# Altium project Glasses.PrjPcb
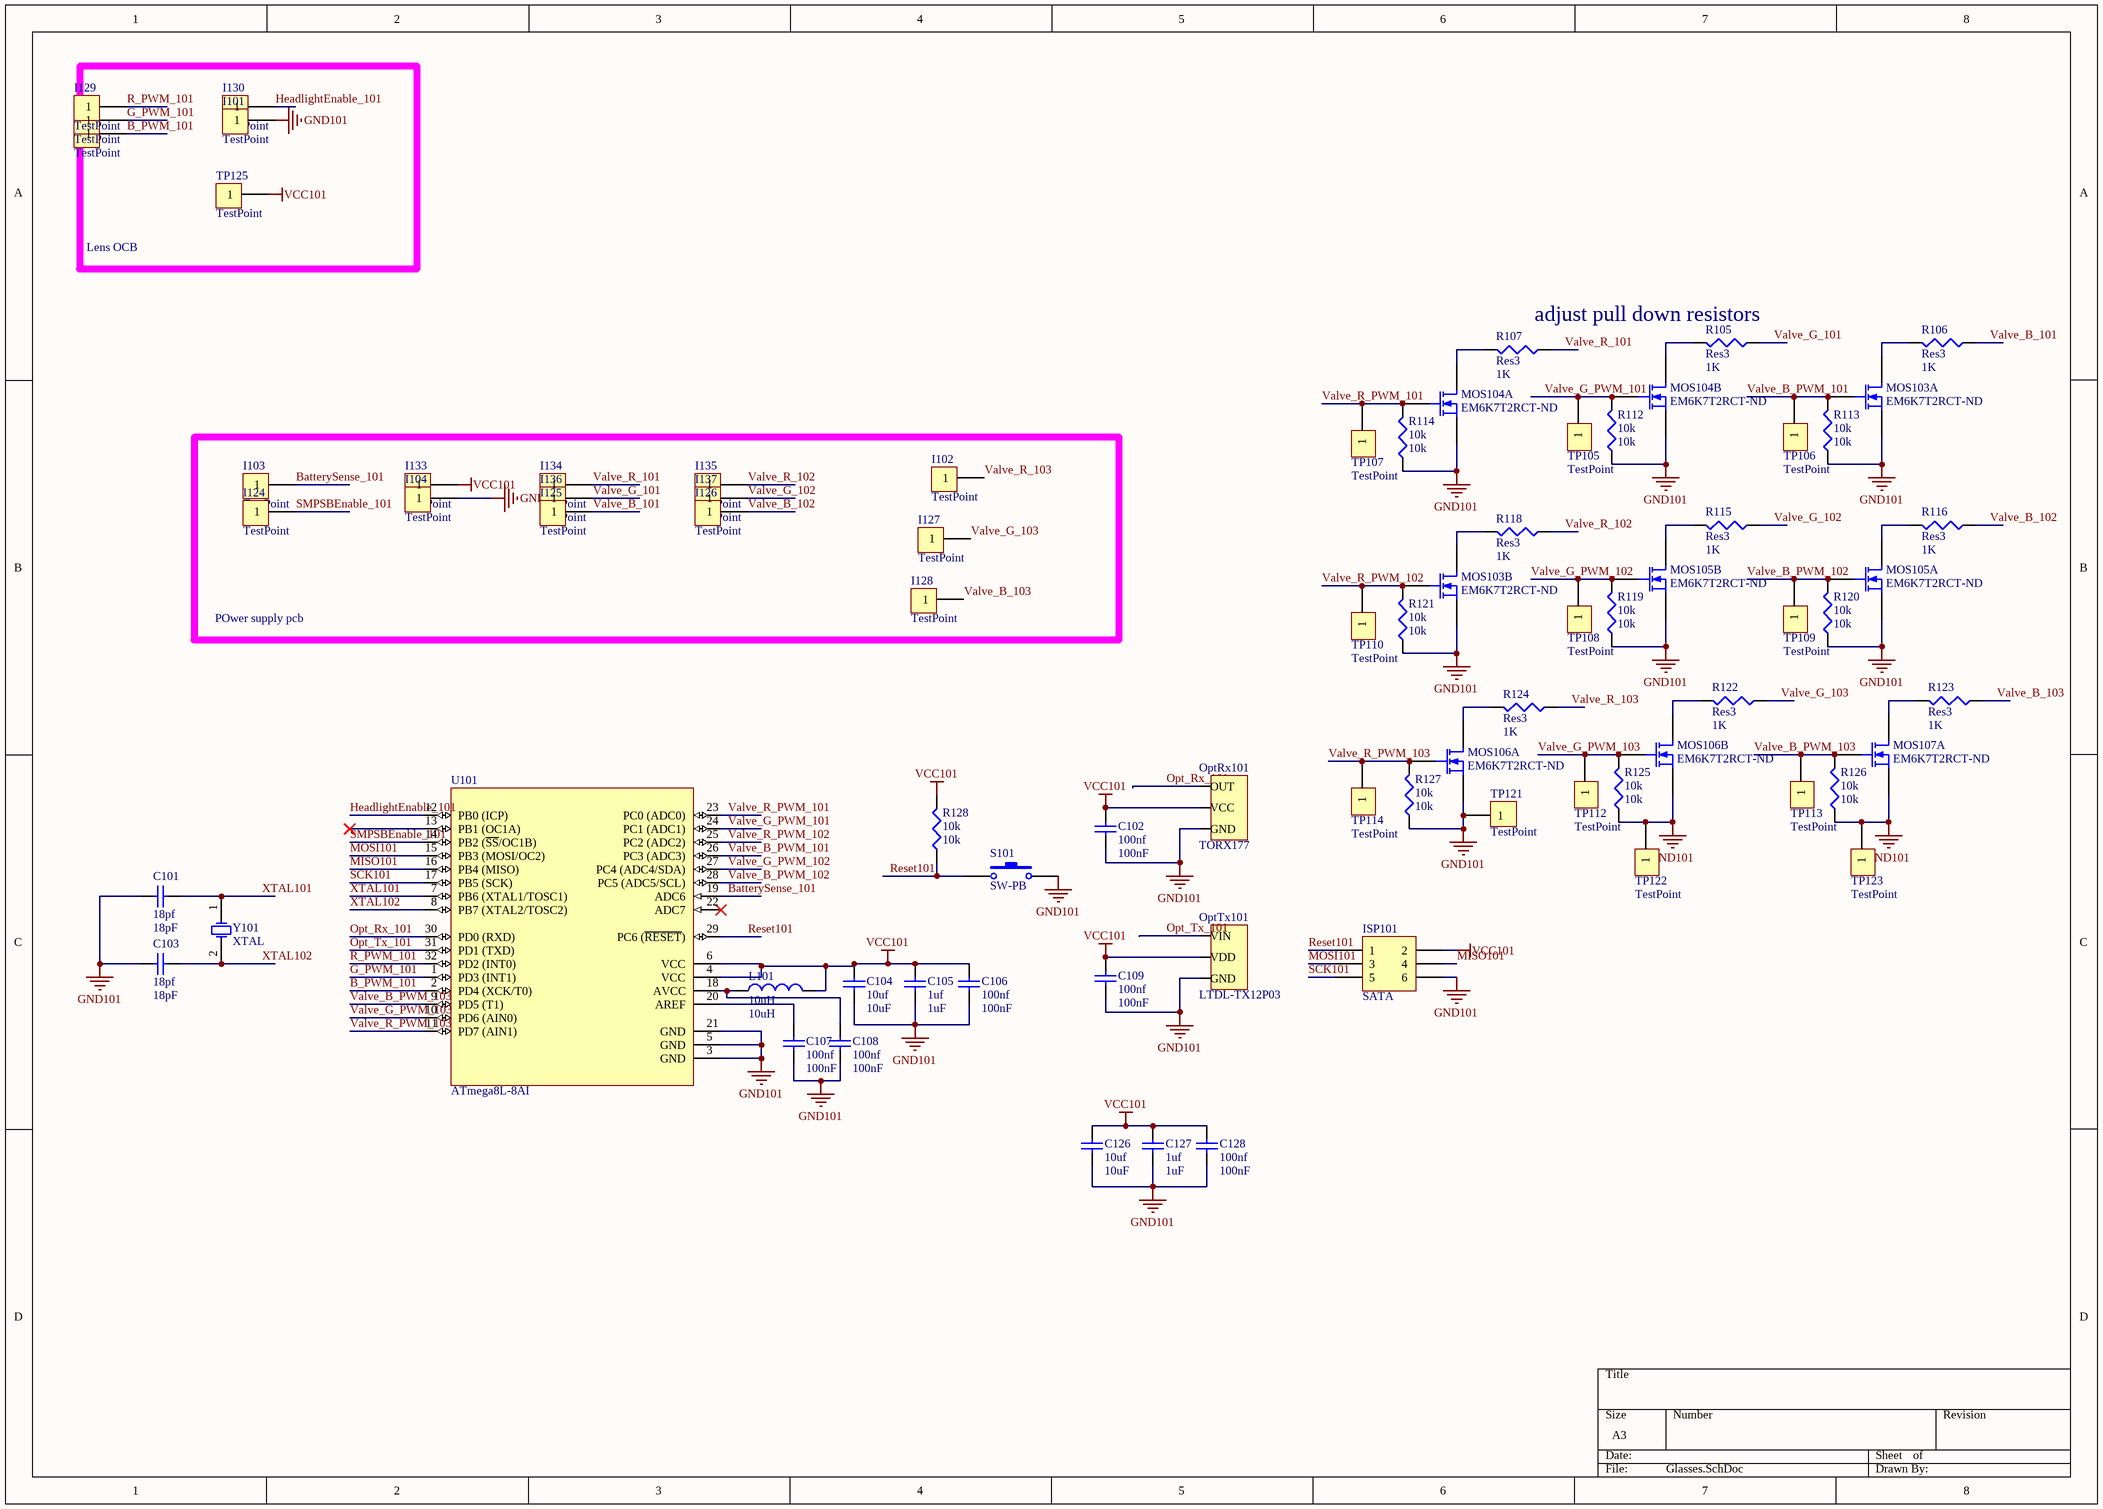
[diagram p0: Glasses.SchDoc]
8 sheets, 519 parts. Net scope: global (net labels, ports and power ports of the same name join across sheets).
Board file: MasterBoard.PcbDoc
Sheets:
  Glasses.SchDoc
  Valve.SchDoc
  Charger.SchDoc
  Controller.SchDoc
  Glasses-LEDBoard.SchDoc
  Glasses-PSUBoard.SchDoc
  Controller-IOBoard.SchDoc
  Glasses-LensBoard.SchDoc

## Sheet Glasses.SchDoc
size A3

### Parts
C101  18pf  [0603]
C102  100nf  [0603]
C103  18pf  [0603]
C104  10uf  [0805]
C105  1uf  [0603]
C106  100nf  [0603]
C107  100nf  [0603]
C108  100nf  [0603]
C109  100nf  [0603]
C126  10uf  [0805]
C127  1uf  [0603]
C128  100nf  [0603]
I101  TestPoint  [TestPoint]
I102  TestPoint  [TestPoint]
I103  TestPoint  [TestPoint]
I104  TestPoint  [TestPoint]
I124  TestPoint  [TestPoint]
I125  TestPoint  [TestPoint]
I126  TestPoint  [TestPoint]
I127  TestPoint  [TestPoint]
I128  TestPoint  [TestPoint]
I129  TestPoint  [TestPoint]
I130  TestPoint  [TestPoint]
I131  TestPoint  [TestPoint]
I132  TestPoint  [TestPoint]
I133  TestPoint  [TestPoint]
I134  TestPoint  [TestPoint]
I135  TestPoint  [TestPoint]
I136  TestPoint  [TestPoint]
I137  TestPoint  [TestPoint]
ISP101  SATA  [SATA]
L101  10uH  [0805]
MOS103  EM6K7T2RCT-ND  [EM6K7T2R-EMT6]  (parts A,B of 2)
MOS104  EM6K7T2RCT-ND  [EM6K7T2R-EMT6]  (parts A,B of 2)
MOS105  EM6K7T2RCT-ND  [EM6K7T2R-EMT6]  (parts A,B of 2)
MOS106  EM6K7T2RCT-ND  [EM6K7T2R-EMT6]  (parts A,B of 2)
MOS107  EM6K7T2RCT-ND  [EM6K7T2R-EMT6]  (part A of 2)
OptRx101  TORX177  [Optical RX]
OptTx101  LTDL-TX12P03  [Optical TX]
R105  Res3  value 1K  [0805]
R106  Res3  value 1K  [0805]
R107  Res3  value 1K  [0805]
R112  10k  [0603]
R113  10k  [0603]
R114  10k  [0603]
R115  Res3  value 1K  [0805]
R116  Res3  value 1K  [0805]
R118  Res3  value 1K  [0805]
R119  10k  [0603]
R120  10k  [0603]
R121  10k  [0603]
R122  Res3  value 1K  [0805]
R123  Res3  value 1K  [0805]
R124  Res3  value 1K  [0805]
R125  10k  [0603]
R126  10k  [0603]
R127  10k  [0603]
R128  10k  [0603]
S101  SW-PB  [2 pin switch (surface mount)]
TP105  TestPoint  [TestPoint]
TP106  TestPoint  [TestPoint]
TP107  TestPoint  [TestPoint]
TP108  TestPoint  [TestPoint]
TP109  TestPoint  [TestPoint]
TP110  TestPoint  [TestPoint]
TP112  TestPoint  [TestPoint]
TP113  TestPoint  [TestPoint]
TP114  TestPoint  [TestPoint]
TP121  TestPoint  [TestPoint]
TP122  TestPoint  [TestPoint]
TP123  TestPoint  [TestPoint]
TP125  TestPoint  [TestPoint]
U101  ATmega8L-8AI  [ATMega_GOOD]
Y101  XTAL  [ABLS-16MHz-B4-T]

### Blocks framed on the sheet
Lens OCB: I101 I129-I132 TP125
POwer supply pcb: I102-I104 I124-I128 I133-I137

### Nets
GND101: C101.1 C102.1 C103.1 C104.1 C105.1 C106.1 C107.1 C108.1 C109.1 C126.1 C127.1 C128.1 I101.1 I104.1 ISP101.6 MOS103.3(S) MOS103.6(S) MOS104.3(S) MOS104.6(S) MOS105.3(S) MOS105.6(S) MOS106.3(S) MOS106.6(S) MOS107.3(S) OptRx101.3(GND) OptTx101.3(GND) R112.1 R113.1 R114.1 R119.1 R120.1 R121.1 R125.1 R126.1 R127.1 S101.2 TP121.1 TP122.1 TP123.1 U101.3(GND) U101.5(GND) U101.21(GND)
VCC101: C102.2 C104.2 C105.2 C106.2 C109.2 C126.2 C127.2 C128.2 I133.1 ISP101.2 L101.2 OptRx101.2(VCC) OptTx101.2(VDD) R128.2 TP125.1 U101.4(VCC) U101.6(VCC)
B_PWM_101: I132.1 U101.2(PD4_(XCK/T0))
BatterySense_101: I103.1 U101.19(ADC6)
G_PWM_101: I131.1 U101.1(PD3_(INT1))
HeadlightEnable_101: I130.1 U101.12(PB0_(ICP))
MISO101: ISP101.4 U101.16(PB4_(MISO))
MOSI101: ISP101.3 U101.15(PB3_(MOSI/OC2))
Opt_Rx_101: OptRx101.1(OUT) U101.30(PD0_(RXD))
Opt_Tx_101: OptTx101.1(VIN) U101.31(PD1_(TXD))
R_PWM_101: I129.1 U101.32(PD2_(INT0))
Reset101: ISP101.1 R128.1 S101.1 U101.29(PC6_(~{RESET}))
SCK101: ISP101.5 U101.17(PB5_(SCK))
SMPSBEnable_101: I124.1 U101.14(PB2_(~{SS}/OC1B))
Valve_B_101: I125.1 R106.1
Valve_B_102: I126.1 R116.1
Valve_B_103: I128.1 R123.1
Valve_B_PWM_101: MOS103.2(G) R113.2 TP106.1 U101.26(PC3_(ADC3))
Valve_B_PWM_102: MOS105.2(G) R120.2 TP109.1 U101.28(PC5_(ADC5/SCL))
Valve_B_PWM_103: MOS107.2(G) R126.2 TP113.1 U101.9(PD5_(T1))
Valve_G_101: I136.1 R105.1
Valve_G_102: I137.1 R115.1
Valve_G_103: I127.1 R122.1
Valve_G_PWM_101: MOS104.5(G) R112.2 TP105.1 U101.24(PC1_(ADC1))
Valve_G_PWM_102: MOS105.5(G) R119.2 TP108.1 U101.27(PC4_(ADC4/SDA))
Valve_G_PWM_103: MOS106.5(G) R125.2 TP112.1 U101.10(PD6_(AIN0))
Valve_R_101: I134.1 R107.1
Valve_R_102: I135.1 R118.1
Valve_R_103: I102.1 R124.1
Valve_R_PWM_101: MOS104.2(G) R114.2 TP107.1 U101.23(PC0_(ADC0))
Valve_R_PWM_102: MOS103.5(G) R121.2 TP110.1 U101.25(PC2_(ADC2))
Valve_R_PWM_103: MOS106.2(G) R127.2 TP114.1 U101.11(PD7_(AIN1))
XTAL101: C101.2 U101.7(PB6_(XTAL1/TOSC1)) Y101.1(OSC1)
XTAL102: C103.2 U101.8(PB7_(XTAL2/TOSC2)) Y101.2(OSC2)
NetC107_2: C107.2 U101.20(AREF)
NetC108_2: C108.2 L101.1 U101.18(AVCC)
NetMOS103_1: MOS103.1(D) R106.2
NetMOS103_4: MOS103.4(D) R118.2
NetMOS104_1: MOS104.1(D) R107.2
NetMOS104_4: MOS104.4(D) R105.2
NetMOS105_1: MOS105.1(D) R116.2
NetMOS105_4: MOS105.4(D) R115.2
NetMOS106_1: MOS106.1(D) R124.2
NetMOS106_4: MOS106.4(D) R122.2
NetMOS107_1: MOS107.1(D) R123.2

Not connected (* = marked no-connect by the designer): U101 13(PB1_(OC1A))* 22(ADC7)*

### Notes on the sheet
- adjust pull down resistors

### Library data of the parts
C101-C109 C126-C128 = Cap Semi: Capacitor (Semiconductor SIM Model); Published: 8-Jun-2000; LatestRevisionDate: 29-May-2009; LatestRevisionNote: IPC-7351 Footprint Added.; PackageReference: C1206; Publisher: Altium Limited; PackageDescription: Chip Capacitor
  C101 C103: Value: 18pF
  C102 C106-C109 C128: Value: 100nF
  C104 C126: Value: 10uF
  C105 C127: Value: 1uF
ISP101 = Header 3X2: Header, 3-Pin, Dual row; LatestRevisionDate: 17-Jul-2002; LatestRevisionNote: Re-released for DXP Platform.; Publisher: Altium Limited
L101 = Inductor: Code_IEC: 1005; Published: 8-Jun-2000; LatestRevisionDate: 29-May-2009; LatestRevisionNote: IPC-7351 Footprint Added.; PackageReference: 0402-A; Publisher: Altium Limited; PackageDescription: Chip Inductor; Code_JEITA: 0402; Value: 10uH
OptRx101 = TORX177: Optical receiver module
OptTx101 = LTDL-TX12P03: Optical transmitter
R105-R107 R112-R116 R118-R128 = Res3: Resistor; Published: 8-Jun-2000; LatestRevisionDate: 29-May-2009; LatestRevisionNote: IPC-7351 Footprint Added.; PackageReference: J1-0603; Publisher: Altium Limited; PackageDescription: Chip Resistor
  R112-R114 R119-R121 R125-R128: Value: 10k
S101 = SW-PB: Switch; Published: 24-Mar-1999; LatestRevisionDate: 17-Jul-2002; LatestRevisionNote: Re-released for DXP Platform.; PackageReference: SPST-2; Publisher: Altium Limited
U101 = ATmega8L-8AI: 8-Bit AVR Microcontroller with 8K Bytes of In-System Programmable Flash Memory; Published: 17-Sep-2003; LatestRevisionDate: 13-Apr-2006; LatestRevisionNote: IPC-7351 Footprint Added.; DatasheetVersion: 2486H-AVR-09/02; PackageVersion: revB, Oct-2001; PackageReference: 32A; Publisher: Altium Limited; PackageDescription: 32-Pin Thin Quad Flat Pack 0.8 mm Pitch; Code_JEDEC: MS-026-ABA; ComponentLink1Description: Manufacturer Link; ComponentLink1URL: http://www.atmel.com; ComponentLink2Description: Datasheet; ComponentLink2URL: http://www.atmel.com/dyn/resources/prod_documents/doc2486.pdf
Y101 = XTAL: Crystal Oscillator; Published: 8-Jun-2000; LatestRevisionDate: 17-Jul-2002; LatestRevisionNote: Re-released for DXP Platform.; PackageReference: R38; Publisher: Altium Limited
MOS103-MOS107 = EM6K7T2RCT-ND: Supplier 1: Digi-Key

## Sheet Valve.SchDoc
size A3
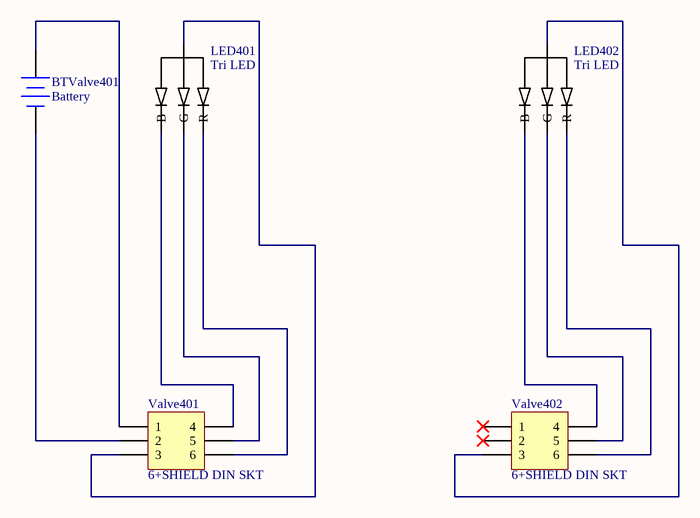
[diagram p1: Valve.SchDoc]

### Parts
BTValve401  Battery  [BAT-2]
LED401  Tri LED  [CLV1A-FKB]
LED402  Tri LED  [CLV1A-FKB]
Valve401  6+SHIELD DIN SKT  [Valve male]
Valve402  6+SHIELD DIN SKT  [Valve male]

### Nets
NetBTValve401_1: BTValve401.1(+) Valve401.1
NetBTValve401_2: BTValve401.2(-) Valve401.2
NetLED401_1: LED401.1(R) Valve401.6
NetLED401_2: LED401.2(Common) Valve401.3
NetLED401_3: LED401.3(B) Valve401.4
NetLED401_4: LED401.4(G) Valve401.5
NetLED402_1: LED402.1(R) Valve402.6
NetLED402_2: LED402.2(Common) Valve402.3
NetLED402_3: LED402.3(B) Valve402.4
NetLED402_4: LED402.4(G) Valve402.5

Not connected (* = marked no-connect by the designer): Valve402 1* 2*

### Library data of the parts
BTValve401 = Battery: Multicell Battery; Published: 24-Mar-1999; LatestRevisionDate: 17-Jul-2002; LatestRevisionNote: Re-released for DXP Platform.; PackageReference: BAT-2; Publisher: Altium Limited
Valve401 Valve402 = Header 3X2A: Header, 3-Pin, Dual row; LatestRevisionDate: 17-Jul-2002; LatestRevisionNote: Re-released for DXP Platform.; Publisher: Altium Limited

## Sheet Charger.SchDoc
size A3
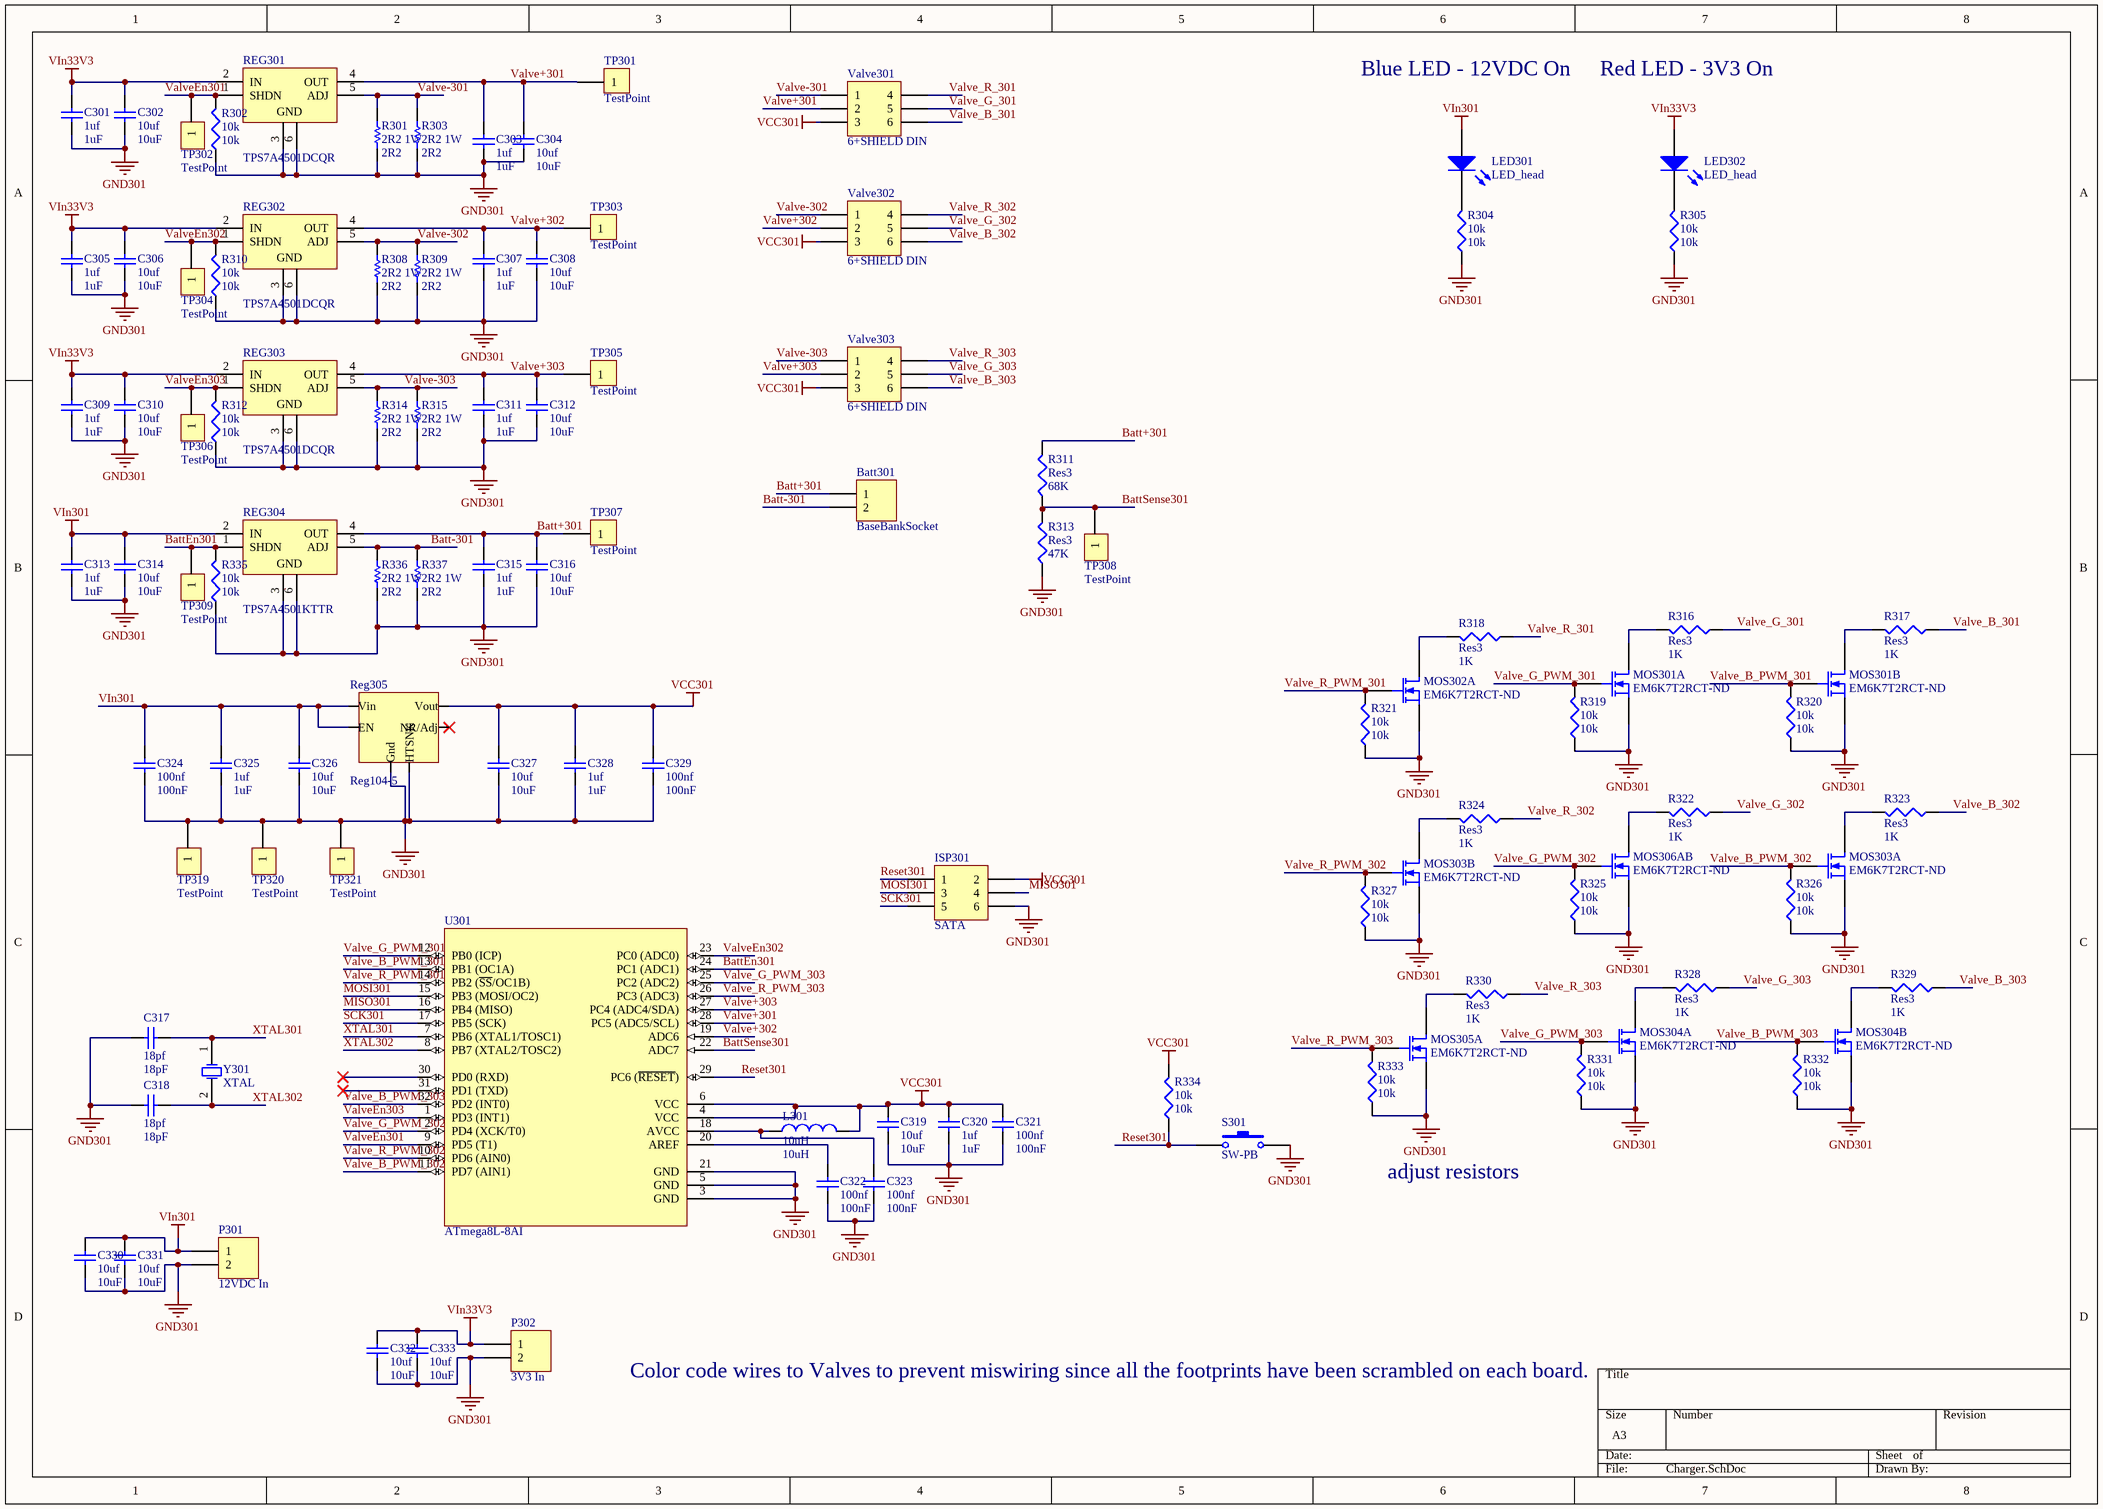
[diagram p2: Charger.SchDoc]

### Parts
Batt301  BaseBankSocket  [HDR1X2H]
C301  1uf  [0603]
C302  10uf  [0805]
C303  1uf  [0603]
C304  10uf  [0805]
C305  1uf  [0603]
C306  10uf  [0805]
C307  1uf  [0603]
C308  10uf  [0805]
C309  1uf  [0603]
C310  10uf  [0805]
C311  1uf  [0603]
C312  10uf  [0805]
C313  1uf  [0603]
C314  10uf  [0805]
C315  1uf  [0603]
C316  10uf  [0805]
C317  18pf  [0603]
C318  18pf  [0603]
C319  10uf  [0805]
C320  1uf  [0603]
C321  100nf  [0603]
C322  100nf  [0603]
C323  100nf  [0603]
C324  100nf  [0603]
C325  1uf  [0603]
C326  10uf  [0805]
C327  10uf  [0805]
C328  1uf  [0603]
C329  100nf  [0603]
C330  10uf  [0805]
C331  10uf  [0805]
C332  10uf  [0805]
C333  10uf  [0805]
ISP301  SATA  [SATA]
L301  10uH  [0805]
LED301  LED_head  [2 pin switch (surface mount)]
LED302  LED_head  [2 pin switch (surface mount)]
MOS301  EM6K7T2RCT-ND  (parts A,B of 2)
MOS302  EM6K7T2RCT-ND  (part A of 2)
MOS303  EM6K7T2RCT-ND  (parts A,B of 2)
MOS304  EM6K7T2RCT-ND  (parts A,B of 2)
MOS305  EM6K7T2RCT-ND  (part A of 2)
MOS306A  EM6K7T2RCT-ND  (part B of 2)
P301  12VDC In  [HDR1X2H]
P302  3V3 In  [HDR1X2H]
R301  2R2 1W  value 2R2  [Resistor 1W]
R302  10k  [0603]
R303  2R2 1W  value 2R2  [Resistor 1W]
R304  10k  [0603]
R305  10k  [0603]
R308  2R2 1W  value 2R2  [Resistor 1W]
R309  2R2 1W  value 2R2  [Resistor 1W]
R310  10k  [0603]
R311  Res3  value 68K  [0805]
R312  10k  [0603]
R313  Res3  value 47K  [0805]
R314  2R2 1W  value 2R2  [Resistor 1W]
R315  2R2 1W  value 2R2  [Resistor 1W]
R316  Res3  value 1K  [0805]
R317  Res3  value 1K  [0805]
R318  Res3  value 1K  [0805]
R319  10k  [0603]
R320  10k  [0603]
R321  10k  [0603]
R322  Res3  value 1K  [0805]
R323  Res3  value 1K  [0805]
R324  Res3  value 1K  [0805]
R325  10k  [0603]
R326  10k  [0603]
R327  10k  [0603]
R328  Res3  value 1K  [0805]
R329  Res3  value 1K  [0805]
R330  Res3  value 1K  [0805]
R331  10k  [0603]
R332  10k  [0603]
R333  10k  [0603]
R334  10k  [0603]
R335  10k  [0603]
R336  2R2 1W  value 2R2  [Resistor 1W]
R337  2R2 1W  value 2R2  [Resistor 1W]
REG301  TPS7A4501DCQR  [TPS7A4501KTTR heatsinked]
REG302  TPS7A4501DCQR  [TPS7A4501KTTR heatsinked]
REG303  TPS7A4501DCQR  [TPS7A4501KTTR heatsinked]
REG304  TPS7A4501KTTR  [TPS7A4501KTTR heatsinked]
Reg305  Reg104-5  [REG104-5-DDPAK5]
S301  SW-PB  [0805]
TP301  TestPoint  [TestPoint]
TP302  TestPoint  [TestPoint]
TP303  TestPoint  [TestPoint]
TP304  TestPoint  [TestPoint]
TP305  TestPoint  [TestPoint]
TP306  TestPoint  [TestPoint]
TP307  TestPoint  [TestPoint]
TP308  TestPoint  [TestPoint]
TP309  TestPoint  [TestPoint]
TP319  TestPoint  [TestPoint]
TP320  TestPoint  [TestPoint]
TP321  TestPoint  [TestPoint]
U301  ATmega8L-8AI  [ATMega_GOOD]
Valve301  6+SHIELD DIN  [Valve male]
Valve302  6+SHIELD DIN  [Valve male]
Valve303  6+SHIELD DIN  [Valve male]
Y301  XTAL  [ABLS-16MHz-B4-T]

### Nets
GND301: C301.1 C302.1 C303.1 C304.1 C305.1 C306.1 C307.1 C308.1 C309.1 C310.1 C311.1 C312.1 C313.1 C314.1 C315.1 C316.1 C317.1 C318.1 C319.1 C320.1 C321.1 C322.1 C323.1 C324.1 C325.1 C326.1 C327.1 C328.1 C329.1 C330.1 C331.1 C332.1 C333.1 ISP301.6 MOS301.1(S) MOS301.4(S) MOS302.1(S) MOS303.1(S) MOS303.4(S) MOS304.1(S) MOS304.4(S) MOS305.1(S) MOS306A.4(S) P301.2 P302.2 R301.2 R302.1 R303.2 R304.1 R305.1 R308.2 R309.2 R310.1 R312.1 R313.1 R314.1 R315.1 R319.1 R320.1 R321.1 R325.1 R326.1 R327.1 R331.1 R332.1 R333.1 R335.1 R336.1 R337.1 REG301.3(GND) REG301.6(GND) REG302.3(GND) REG302.6(GND) REG303.3(GND) REG303.6(GND) REG304.3(GND) REG304.6(GND) Reg305.3(Gnd) Reg305.6(HTSNK) S301.2 TP319.1 TP320.1 TP321.1 U301.3(GND) U301.5(GND) U301.21(GND)
VCC301: C319.2 C320.2 C321.2 C327.2 C328.2 C329.2 ISP301.2 L301.2 R334.2 Reg305.2(Vout) U301.4(VCC) U301.6(VCC) Valve301.3 Valve302.3 Valve303.3
VIn33V3: C301.2 C302.2 C305.2 C306.2 C309.2 C310.2 C332.2 C333.2 LED302.1(A) P302.1 REG301.2(IN) REG302.2(IN) REG303.2(IN)
VIn301: C313.2 C314.2 C324.2 C325.2 C326.2 C330.2 C331.2 LED301.1(A) P301.1 REG304.2(IN) Reg305.1(Vin) Reg305.5(EN)
Batt+301: Batt301.1 C315.2 C316.2 R311.2 REG304.4(OUT) TP307.1
Batt-301: Batt301.2 R336.2 R337.2 REG304.5(ADJ)
BattEn301: R335.2 REG304.1(SHDN) TP309.1 U301.24(PC1_(ADC1))
BattSense301: R311.1 R313.2 TP308.1 U301.22(ADC7)
MISO301: ISP301.4 U301.16(PB4_(MISO))
MOSI301: ISP301.3 U301.15(PB3_(MOSI/OC2))
Reset301: ISP301.1 R334.1 S301.1 U301.29(PC6_(~{RESET}))
SCK301: ISP301.5 U301.17(PB5_(SCK))
Valve+301: C303.2 C304.2 REG301.4(OUT) TP301.1 U301.28(PC5_(ADC5/SCL)) Valve301.2
Valve+302: C307.2 C308.2 REG302.4(OUT) TP303.1 U301.19(ADC6) Valve302.2
Valve+303: C311.2 C312.2 REG303.4(OUT) TP305.1 U301.27(PC4_(ADC4/SDA)) Valve303.2
Valve-301: R301.1 R303.1 REG301.5(ADJ) Valve301.1
Valve-302: R308.1 R309.1 REG302.5(ADJ) Valve302.1
Valve-303: R314.2 R315.2 REG303.5(ADJ) Valve303.1
Valve_B_301: R317.1 Valve301.6
Valve_B_302: R323.1 Valve302.6
Valve_B_303: R329.1 Valve303.6
Valve_B_PWM_301: MOS301.5(G) R320.2 U301.13(PB1_(OC1A))
Valve_B_PWM_302: MOS303.2(G) R326.2 U301.11(PD7_(AIN1))
Valve_B_PWM_303: MOS304.5(G) R332.2 U301.32(PD2_(INT0))
Valve_G_301: R316.1 Valve301.5
Valve_G_302: R322.1 Valve302.5
Valve_G_303: R328.1 Valve303.5
Valve_G_PWM_301: MOS301.2(G) R319.2 U301.12(PB0_(ICP))
Valve_G_PWM_302: MOS306A.5(G) R325.2 U301.2(PD4_(XCK/T0))
Valve_G_PWM_303: MOS304.2(G) R331.2 U301.25(PC2_(ADC2))
Valve_R_301: R318.1 Valve301.4
Valve_R_302: R324.1 Valve302.4
Valve_R_303: R330.1 Valve303.4
Valve_R_PWM_301: MOS302.2(G) R321.2 U301.14(PB2_(~{SS}/OC1B))
Valve_R_PWM_302: MOS303.5(G) R327.2 U301.10(PD6_(AIN0))
Valve_R_PWM_303: MOS305.2(G) R333.2 U301.26(PC3_(ADC3))
ValveEn301: R302.2 REG301.1(SHDN) TP302.1 U301.9(PD5_(T1))
ValveEn302: R310.2 REG302.1(SHDN) TP304.1 U301.23(PC0_(ADC0))
ValveEn303: R312.2 REG303.1(SHDN) TP306.1 U301.1(PD3_(INT1))
XTAL301: C317.2 U301.7(PB6_(XTAL1/TOSC1)) Y301.1(OSC1)
XTAL302: C318.2 U301.8(PB7_(XTAL2/TOSC2)) Y301.2(OSC2)
NetC322_2: C322.2 U301.20(AREF)
NetC323_2: C323.2 L301.1 U301.18(AVCC)
NetLED301_2: LED301.2(K) R304.2
NetLED302_2: LED302.2(K) R305.2
NetMOS301_3: MOS301.3(D) R317.2
NetMOS301_6: MOS301.6(D) R316.2
NetMOS302_6: MOS302.6(D) R318.2
NetMOS303_3: MOS303.3(D) R324.2
NetMOS303_6: MOS303.6(D) R323.2
NetMOS304_3: MOS304.3(D) R329.2
NetMOS304_6: MOS304.6(D) R328.2
NetMOS305_6: MOS305.6(D) R330.2
NetMOS306A_3: MOS306A.3(D) R322.2

Not connected (* = marked no-connect by the designer): Reg305 4(NR/Adj)*; U301 30(PD0_(RXD))* 31(PD1_(TXD))*

### Notes on the sheet
- Blue LED - 12VDC On
- Red LED - 3V3 On
- adjust resistors
- Color code wires to Valves to prevent miswiring since all the footprints have been scrambled on each board.

### Library data of the parts
Batt301 = Header 2: Header, 2-Pin; LatestRevisionDate: 17-Jul-2002; LatestRevisionNote: Re-released for DXP Platform.; Publisher: Altium Limited
C301-C333 = Cap Semi: Capacitor (Semiconductor SIM Model); Published: 8-Jun-2000; LatestRevisionDate: 29-May-2009; LatestRevisionNote: IPC-7351 Footprint Added.; PackageReference: C1206; Publisher: Altium Limited; PackageDescription: Chip Capacitor
  C301 C303 C305 C307 C309 C311 C313 C315 C320 C325 C328: Value: 1uF
  C302 C304 C306 C308 C310 C312 C314 C316 C319 C326 C327 C330-C333: Value: 10uF
  C317 C318: Value: 18pF
  C321-C324 C329: Value: 100nF
ISP301 = Header 3X2: Header, 3-Pin, Dual row; LatestRevisionDate: 17-Jul-2002; LatestRevisionNote: Re-released for DXP Platform.; Publisher: Altium Limited
L301 = Inductor: Code_IEC: 1005; Published: 8-Jun-2000; LatestRevisionDate: 29-May-2009; LatestRevisionNote: IPC-7351 Footprint Added.; PackageReference: 0402-A; Publisher: Altium Limited; PackageDescription: Chip Inductor; Code_JEITA: 0402; Value: 10uH
LED301 LED302 = LED0: Typical INFRARED GaAs LED; Published: 8-Jun-2000; LatestRevisionDate: 08-Jul-2005; LatestRevisionNote: Mech Layer 1 removed.; PackageReference: LED-0; Publisher: Altium Limited
P301 P302 = Header 2H: Header, 2-Pin, Right Angle; LatestRevisionDate: 17-Jul-2002; LatestRevisionNote: Re-released for DXP Platform.; Publisher: Altium Limited
R301 R303 R308 R309 R314 R315 R336 R337 = Res1: Resistor; Published: 8-Jun-2000; LatestRevisionDate: 17-Jul-2002; LatestRevisionNote: Re-released for DXP Platform.; PackageReference: AXIAL-0.3; Publisher: Altium Limited
R302 R304 R305 R310-R313 R316-R335 = Res3: Resistor; Published: 8-Jun-2000; LatestRevisionDate: 29-May-2009; LatestRevisionNote: IPC-7351 Footprint Added.; PackageReference: J1-0603; Publisher: Altium Limited; PackageDescription: Chip Resistor
  R302 R304 R305 R310 R312 R319-R321 R325-R327 R331-R335: Value: 10k
REG301-REG303 = TPS7A4515
REG304 = TPS7A4501
S301 = SW-PB: Switch; Published: 24-Mar-1999; LatestRevisionDate: 17-Jul-2002; LatestRevisionNote: Re-released for DXP Platform.; PackageReference: SPST-2; Publisher: Altium Limited
U301 = ATmega8L-8AI: as U101 on sheet Glasses; Published: 17-Sep-2003; LatestRevisionDate: 13-Apr-2006; LatestRevisionNote: IPC-7351 Footprint Added.; DatasheetVersion: 2486H-AVR-09/02; PackageVersion: revB, Oct-2001; PackageReference: 32A; Publisher: Altium Limited; PackageDescription: 32-Pin Thin Quad Flat Pack 0.8 mm Pitch; Code_JEDEC: MS-026-ABA; ComponentLink1Description: Manufacturer Link; ComponentLink1URL: http://www.atmel.com; ComponentLink2Description: Datasheet; ComponentLink2URL: http://www.atmel.com/dyn/resources/prod_documents/doc2486.pdf
Valve301-Valve303 = Header 3X2A: Header, 3-Pin, Dual row; LatestRevisionDate: 17-Jul-2002; LatestRevisionNote: Re-released for DXP Platform.; Publisher: Altium Limited
Y301 = XTAL: Crystal Oscillator; Published: 8-Jun-2000; LatestRevisionDate: 17-Jul-2002; LatestRevisionNote: Re-released for DXP Platform.; PackageReference: R38; Publisher: Altium Limited
MOS301-MOS305 MOS306A = EM6K7T2RCT-ND: Supplier 1: Digi-Key

## Sheet Controller.SchDoc
size A2
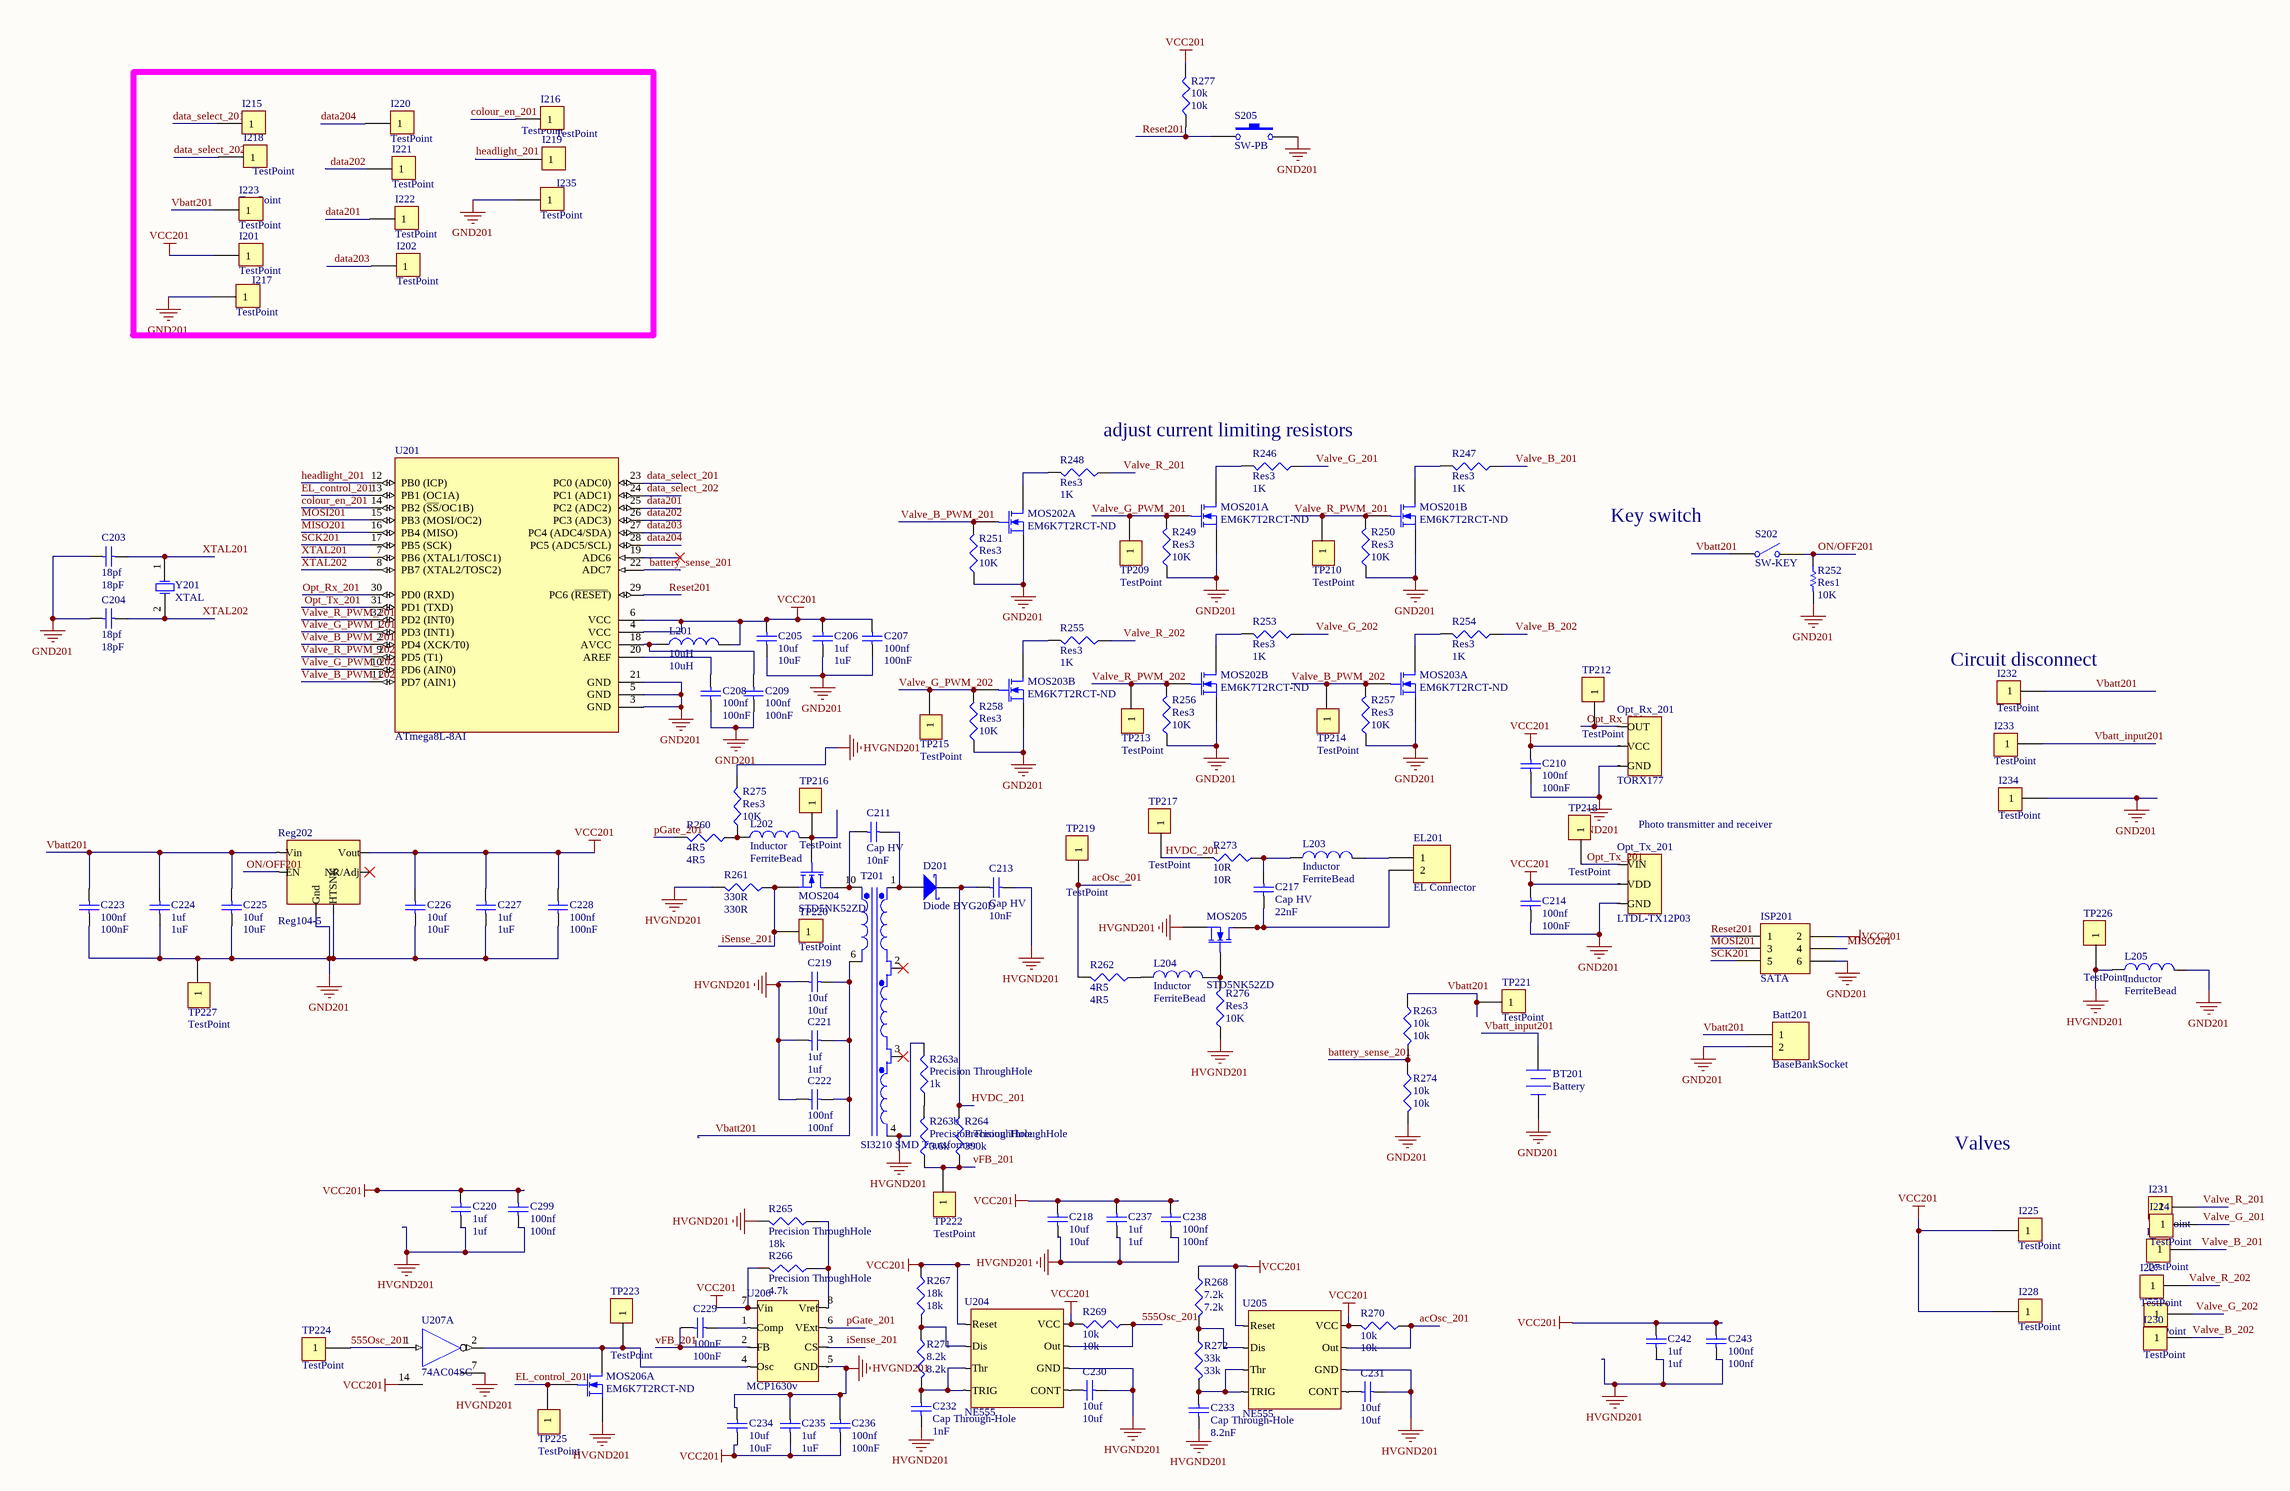
[diagram p3: Controller.SchDoc]

### Parts
Batt201  BaseBankSocket  [HDR1X2H]
BT201  Battery  [HDR1X2H]
C203  18pf  [0603]
C204  18pf  [0603]
C205  10uf  [0805]
C206  1uf  [0603]
C207  100nf  [0603]
C208  100nf  [0603]
C209  100nf  [0603]
C210  100nf  [0603]
C211  Cap HV  value 10nF  [10n MU Capacitor (HV)]
C213  Cap HV  value 10nF  [10n MU Capacitor (HV)]
C214  100nf  [0603]
C217  Cap HV  value 22nF  [22N MU Capacitor (HV)]
C218  10uf  [0805]
C219  10uf  [0805]
C220  1uf  [0603]
C221  1uf  [0603]
C222  100nf  [0603]
C223  100nf  [0603]
C224  1uf  [0603]
C225  10uf  [0805]
C226  10uf  [0805]
C227  1uf  [0603]
C228  100nf  [0603]
C229  100nF  [0603]
C230  10uf  [0805]
C231  10uf  [0805]
C232  Cap Through-Hole  value 1nF  [Axial 0.4 MU]
C233  Cap Through-Hole  value 8.2nF  [Axial 0.4 MU]
C234  10uf  [0805]
C235  1uf  [0603]
C236  100nf  [0603]
C237  1uf  [0603]
C238  100nf  [0603]
C242  1uf  [0603]
C243  100nf  [0603]
C299  100nf  [0603]
D201  Diode BYG20D  [BYG20J-E3]
EL201  EL Connector  [HV connector]
I201  TestPoint  [TestPoint]
I202  TestPoint  [TestPoint]
I215  TestPoint  [TestPoint]
I216  TestPoint  [TestPoint]
I217  TestPoint  [TestPoint]
I218  TestPoint  [TestPoint]
I219  TestPoint  [TestPoint]
I220  TestPoint  [TestPoint]
I221  TestPoint  [TestPoint]
I222  TestPoint  [TestPoint]
I223  TestPoint  [TestPoint]
I224  TestPoint  [TestPoint]
I225  TestPoint  [TestPoint]
I226  TestPoint  [TestPoint]
I227  TestPoint  [TestPoint]
I228  TestPoint  [TestPoint]
I229  TestPoint  [TestPoint]
I230  TestPoint  [TestPoint]
I231  TestPoint  [TestPoint]
I232  TestPoint  [TestPoint]
I233  TestPoint  [TestPoint]
I234  TestPoint  [TestPoint]
I235  TestPoint  [TestPoint]
ISP201  SATA  [SATA]
L201  10uH  [0805]
L202  Inductor  value FerriteBead  [Axial 0.4 MU]
L203  Inductor  value FerriteBead  [Axial 0.4 MU]
L204  Inductor  value FerriteBead  [Axial 0.4 MU]
L205  Inductor  value FerriteBead  [Axial 0.4 MU]
MOS201  EM6K7T2RCT-ND  [EM6K7T2R-EMT6]  (parts A,B of 2)
MOS202  EM6K7T2RCT-ND  [EM6K7T2R-EMT6]  (parts A,B of 2)
MOS203  EM6K7T2RCT-ND  [EM6K7T2R-EMT6]  (parts A,B of 2)
MOS204  STD5NK52ZD  [DPAK]
MOS205  STD5NK52ZD  [DPAK]
MOS206  EM6K7T2RCT-ND  [EM6K7T2R-EMT6]  (part A of 2)
Opt_Rx_201  TORX177  [Optical RX]
Opt_Tx_201  LTDL-TX12P03  [Optical TX]
R246  Res3  value 1K  [0805]
R247  Res3  value 1K  [0805]
R248  Res3  value 1K  [0805]
R249  Res3  value 10K  [0805]
R250  Res3  value 10K  [0805]
R251  Res3  value 10K  [0805]
R252  Res1  value 10K  [0805]
R253  Res3  value 1K  [0805]
R254  Res3  value 1K  [0805]
R255  Res3  value 1K  [0805]
R256  Res3  value 10K  [0805]
R257  Res3  value 10K  [0805]
R258  Res3  value 10K  [0805]
R260  4R5  [0805]
R261  330R  [0805]
R262  4R5  [0805]
R263  10k  [0603]
R263a  Precision ThroughHole  value 1k  [Axial 0.4 MU]
R263b  Precision ThroughHole  value 3.6k  [Axial 0.4 MU]
R264  Precision ThroughHole  value 390k  [Axial 0.4 MU]
R265  Precision ThroughHole  value 18k  [Axial 0.4 MU]
R266  Precision ThroughHole  value 4.7k  [Axial 0.4 MU]
R267  18k  [0603]
R268  7.2k  [0805]
R269  10k  [0603]
R270  10k  [0603]
R271  8.2k  [0805]
R272  33k  [0805]
R273  10R  [0805]
R274  10k  [0603]
R275  Res3  value 10K  [0805]
R276  Res3  value 10K  [0805]
R277  10k  [0603]
Reg202  Reg104-5  [REG104-5-DDPAK5]
S202  SW-KEY  [2 pin switch (surface mount)]
S205  SW-PB  [2 pin switch (surface mount)]
T201  SI3210 SMD Transformer  [SI3210 SMD Transformer]
TP209  TestPoint  [TestPoint]
TP210  TestPoint  [TestPoint]
TP212  TestPoint  [TestPoint]
TP213  TestPoint  [TestPoint]
TP214  TestPoint  [TestPoint]
TP215  TestPoint  [TestPoint]
TP216  TestPoint  [TestPoint]
TP217  TestPoint  [TestPoint]
TP218  TestPoint  [TestPoint]
TP219  TestPoint  [TestPoint]
TP220  TestPoint  [TestPoint]
TP221  TestPoint  [TestPoint]
TP222  TestPoint  [TestPoint]
TP223  TestPoint  [TestPoint]
TP224  TestPoint  [TestPoint]
TP225  TestPoint  [TestPoint]
TP226  TestPoint  [TestPoint]
TP227  TestPoint  [TestPoint]
U201  ATmega8L-8AI  [ATMega_GOOD]
U204  NE555  [NE555]
U205  NE555  [NE555]
U206  MCP1630v  [8MSOP (MCP Alternative)]
U207  74AC04SC  [74AC04SC 14-SOIC]  (part A of 6)
Y201  XTAL  [ABLS-16MHz-B4-T]

### Nets
GND: C213.1 C218.2 C219.2 C220.2 C221.2 C222.2 C230.1 C231.1 C232.1 C233.1 C234.2 C235.2 C236.2 C237.2 C238.2 C242.2 C243.2 C299.2 L205.1 MOS205.3(S) MOS206.1(S) R261.2 R263a.2 R265.2 R275.2 R276.1 T201.4(Sec3-) TP226.1 U204.1(GND) U205.1(GND) U206.5(GND) U207.7(GND)  [also labelled HVGND201]
GND201: Batt201.2 BT201.2(-) C203.1 C204.1 C205.1 C206.1 C207.1 C208.1 C209.1 C210.1 C214.1 C223.1 C224.1 C225.1 C226.1 C227.1 C228.1 I217.1 I234.1 I235.1 ISP201.6 L205.2 MOS201.1(S) MOS201.4(S) MOS202.1(S) MOS202.4(S) MOS203.1(S) MOS203.4(S) Opt_Rx_201.2(GND) Opt_Tx_201.3(GND) R249.1 R250.1 R251.1 R252.2 R256.1 R257.1 R258.1 R274.2 Reg202.3(Gnd) Reg202.6(HTSNK) S205.2 TP227.1 U201.3(GND) U201.5(GND) U201.21(GND)
VCC: C205.2 C206.2 C207.2 C210.2 C214.2 C218.1 C220.1 C226.2 C227.2 C228.2 C234.1 C235.1 C236.1 C237.1 C238.1 C242.1 C243.1 C299.1 I201.1 I225.1 I228.1 ISP201.2 L201.2 Opt_Rx_201.3(VCC) Opt_Tx_201.2(VDD) R266.2 R267.1 R268.1 R269.2 R270.2 R277.2 Reg202.2(Vout) U201.4(VCC) U201.6(VCC) U204.4(Reset) U204.8(VCC) U205.4(Reset) U205.8(VCC) U206.7(Vin) U207.14(VCC)  [also labelled VCC201]
555Osc_201: R269.1 TP224.1 U204.3(Out) U207.1(A)
acOsc_201: R262.2 R270.1 TP219.1 U205.3(Out)
battery_sense_201: R263.2 R274.1 U201.22(ADC7)
colour_en_201: I216.1 U201.14(PB2_(~{SS}/OC1B))
data201: I222.1 U201.25(PC2_(ADC2))
data202: I221.1 U201.26(PC3_(ADC3))
data203: I202.1 U201.27(PC4_(ADC4/SDA))
data204: I220.1 U201.28(PC5_(ADC5/SCL))
data_select_201: I215.1 U201.23(PC0_(ADC0))
data_select_202: I218.1 U201.24(PC1_(ADC1))
EL_control_201: MOS206.2(G) TP225.1 U201.13(PB1_(OC1A))
headlight_201: I219.1 U201.12(PB0_(ICP))
HVDC_201: C213.2 D201.1(K) R264.2 R273.1 TP217.1
iSense_201: MOS204.3(S) R261.1 TP220.1 U206.3(CS)
MISO201: ISP201.4 U201.16(PB4_(MISO))
MOSI201: ISP201.3 U201.15(PB3_(MOSI/OC2))
ON/OFF201: R252.1 Reg202.5(EN) S202.2(NO)
Opt_Rx_201: Opt_Rx_201.1(OUT) TP212.1 U201.30(PD0_(RXD))
Opt_Tx_201: Opt_Tx_201.1(VIN) TP218.1 U201.31(PD1_(TXD))
pGate_201: R260.2 U206.6(VExt)
Reset201: ISP201.1 R277.1 S205.1 U201.29(PC6_(~{RESET}))
SCK201: ISP201.5 U201.17(PB5_(SCK))
Valve_B_201: I226.1 R247.1
Valve_B_202: I230.1 R254.1
Valve_B_PWM_201: MOS202.2(G) R251.2 U201.2(PD4_(XCK/T0))
Valve_B_PWM_202: MOS203.2(G) R257.2 TP214.1 U201.11(PD7_(AIN1))
Valve_G_201: I224.1 R246.1
Valve_G_202: I229.1 R253.1
Valve_G_PWM_201: MOS201.2(G) R249.2 TP209.1 U201.1(PD3_(INT1))
Valve_G_PWM_202: MOS203.5(G) R258.2 TP215.1 U201.10(PD6_(AIN0))
Valve_R_201: I231.1 R248.1
Valve_R_202: I227.1 R255.1
Valve_R_PWM_201: MOS201.5(G) R250.2 TP210.1 U201.32(PD2_(INT0))
Valve_R_PWM_202: MOS202.5(G) R256.2 TP213.1 U201.9(PD5_(T1))
Vbatt201: Batt201.1 C219.1 C221.1 C222.1 C223.2 C224.2 C225.2 I223.1 I232.1 R263.1 Reg202.1(Vin) S202.1(COMMON) T201.6(Pri-) TP221.1
Vbatt_input201: BT201.1(+) I233.1
vFB_201: C229.2 R263b.1 R264.1 TP222.1 U206.2(FB)
XTAL201: C203.2 U201.7(PB6_(XTAL1/TOSC1)) Y201.1(OSC1)
XTAL202: C204.2 U201.8(PB7_(XTAL2/TOSC2)) Y201.2(OSC2)
NetC208_2: C208.2 U201.20(AREF)
NetC209_2: C209.2 L201.1 U201.18(AVCC)
NetC211_1: C211.1 D201.3(A) T201.1(Sec1+)
NetC211_2: C211.2 MOS204.1(D) T201.10(Pri+)
NetC217_1: C217.1 EL201.2 MOS205.1(D)
NetC217_2: C217.2 L203.1 R273.2
NetC229_1: C229.1 U206.1(Comp)
NetC230_2: C230.2 U204.5(CONT)
NetC231_2: C231.2 U205.5(CONT)
NetC232_2: C232.2 R271.2 U204.2(TRIG) U204.6(Thr)
NetC233_2: C233.2 R272.2 U205.2(TRIG) U205.6(Thr)
NetEL201_1: EL201.1 L203.2
NetL202_1: L202.1 R260.1 R275.1
NetL202_2: L202.2 MOS204.2(G) TP216.1
NetL204_1: L204.1 R262.1
NetL204_2: L204.2 MOS205.2(G) R276.2
NetMOS201_3: MOS201.3(D) R247.2
NetMOS201_6: MOS201.6(D) R246.2
NetMOS202_3: MOS202.3(D) R253.2
NetMOS202_6: MOS202.6(D) R248.2
NetMOS203_3: MOS203.3(D) R255.2
NetMOS203_6: MOS203.6(D) R254.2
NetMOS206_6: MOS206.6(D) TP223.1 U206.4(Osc) U207.2(Y)
NetR263a_1: R263a.1 R263b.2
NetR265_1: R265.1 R266.1 U206.8(Vref)
NetR267_2: R267.2 R271.1 U204.7(Dis)
NetR268_2: R268.2 R272.1 U205.7(Dis)

Not connected (* = marked no-connect by the designer): Reg202 4(NR/Adj)*; T201 2(Sec2+)* 3(Sec3+)*; U201 19(ADC6)*

### Notes on the sheet
- adjust current limiting resistors
- Key switch
- (near I232) Circuit disconnect
- Photo transmitter and receiver
- Valves

### Library data of the parts
Batt201 EL201 = Header 2: Header, 2-Pin; LatestRevisionDate: 17-Jul-2002; LatestRevisionNote: Re-released for DXP Platform.; Publisher: Altium Limited
BT201 = Battery: Multicell Battery; Published: 24-Mar-1999; LatestRevisionDate: 17-Jul-2002; LatestRevisionNote: Re-released for DXP Platform.; PackageReference: BAT-2; Publisher: Altium Limited
C203-C211 C213 C214 C217-C238 C242 C243 C299 = Cap Semi: Capacitor (Semiconductor SIM Model); Published: 8-Jun-2000; LatestRevisionDate: 29-May-2009; LatestRevisionNote: IPC-7351 Footprint Added.; PackageReference: C1206; Publisher: Altium Limited; PackageDescription: Chip Capacitor
  C203 C204: Value: 18pF
  C205 C225 C226 C234: Value: 10uF
  C206 C224 C227 C235: Value: 1uF
  C207-C210 C214 C223 C228 C229 C236: Value: 100nF
  C218 C219 C230 C231: Value: 10uf
  C220 C221 C237 C242: Value: 1uf
  C222 C238 C243 C299: Value: 100nf
D201 = Diode 10TQ035: Schottky Rectifier; Note: Terminal 2 is the TAB and is electrically connected to the cathode; Published: 8-Jun-2000; LatestRevisionDate: 17-Jul-2002; LatestRevisionNote: Re-released for DXP Platform.; DatasheetVersion: PD-2.057B; PackageVersion: Feb-1998; PackageReference: TO-220AC; Publisher: Altium Limited; ComponentLink1Description: Manufacturer Link; ComponentLink1URL: http://www.irf.com/; ComponentLink2Description: Datasheet; ComponentLink2URL: http://www.irf.com/product-info/datasheets/data/10tq.pdf
ISP201 = Header 3X2: Header, 3-Pin, Dual row; LatestRevisionDate: 17-Jul-2002; LatestRevisionNote: Re-released for DXP Platform.; Publisher: Altium Limited
L201-L205 = Inductor: Code_IEC: 1005; Published: 8-Jun-2000; LatestRevisionDate: 29-May-2009; LatestRevisionNote: IPC-7351 Footprint Added.; PackageReference: 0402-A; Publisher: Altium Limited; PackageDescription: Chip Inductor; Code_JEITA: 0402
  L201: Value: 10uH
MOS204 MOS205 = MOSFET-N: N-Channel MOSFET; Published: 8-Jun-2000; LatestRevisionDate: 17-Jul-2002; LatestRevisionNote: Re-released for DXP Platform.; PackageVersion: 1995/1996; PackageReference: E3; Publisher: Altium Limited
Opt_Rx_201 = TORX177: Optical receiver module
Opt_Tx_201 = LTDL-TX12P03: Optical transmitter
R246-R251 R253-R258 R260-R263 R263a R263b R264-R277 = Res3: Resistor; Published: 8-Jun-2000; LatestRevisionDate: 29-May-2009; LatestRevisionNote: IPC-7351 Footprint Added.; PackageReference: J1-0603; Publisher: Altium Limited; PackageDescription: Chip Resistor
  R260 R262: Value: 4R5
  R261: Value: 330R
  R263 R269 R270 R274 R277: Value: 10k
  R267: Value: 18k
  R268: Value: 7.2k
  R271: Value: 8.2k
  R272: Value: 33k
  R273: Value: 10R
R252 = Res1: Resistor; Published: 8-Jun-2000; LatestRevisionDate: 17-Jul-2002; LatestRevisionNote: Re-released for DXP Platform.; PackageReference: AXIAL-0.3; Publisher: Altium Limited
S202 = SW-SPST: Single-Pole, Single-Throw Switch; Published: 24-Mar-1999; LatestRevisionDate: 17-Jul-2002; LatestRevisionNote: Re-released for DXP Platform.; PackageReference: SPST-2; Publisher: Altium Limited
S205 = SW-PB: Switch; Published: 24-Mar-1999; LatestRevisionDate: 17-Jul-2002; LatestRevisionNote: Re-released for DXP Platform.; PackageReference: SPST-2; Publisher: Altium Limited
U201 = ATmega8L-8AI: as U101 on sheet Glasses; Published: 17-Sep-2003; LatestRevisionDate: 13-Apr-2006; LatestRevisionNote: IPC-7351 Footprint Added.; DatasheetVersion: 2486H-AVR-09/02; PackageVersion: revB, Oct-2001; PackageReference: 32A; Publisher: Altium Limited; PackageDescription: 32-Pin Thin Quad Flat Pack 0.8 mm Pitch; Code_JEDEC: MS-026-ABA; ComponentLink1Description: Manufacturer Link; ComponentLink1URL: http://www.atmel.com; ComponentLink2Description: Datasheet; ComponentLink2URL: http://www.atmel.com/dyn/resources/prod_documents/doc2486.pdf
U207 = SN54HC04J: Hex Inverter; Published: 8-Jun-2000; LatestRevisionDate: 04-Mar-2005; LatestRevisionNote: Stylized 3D Model Added.; DatasheetVersion: May-1997; PackageVersion: Jun-1999; PackageReference: J014; Publisher: Altium Limited; PackageDescription: DIP; 14 Leads; Row Spacing 7.62 mm; Pitch 2.54 mm; ComponentLink1Description: Manufacturer Link; ComponentLink1URL: http://www.ti.com/; ComponentLink2Description: Datasheet; ComponentLink2URL: http://www-s.ti.com/sc/ds/sn54hc04.pdf; ComponentLink3Description: Packaging Specification; ComponentLink3URL: http://focus.ti.com/lit/ml/mcer002d/mcer002d.pdf
Y201 = XTAL: Crystal Oscillator; Published: 8-Jun-2000; LatestRevisionDate: 17-Jul-2002; LatestRevisionNote: Re-released for DXP Platform.; PackageReference: R38; Publisher: Altium Limited
MOS201-MOS203 MOS206 = EM6K7T2RCT-ND: Supplier 1: Digi-Key

## Sheet Glasses-LEDBoard.SchDoc
size A4
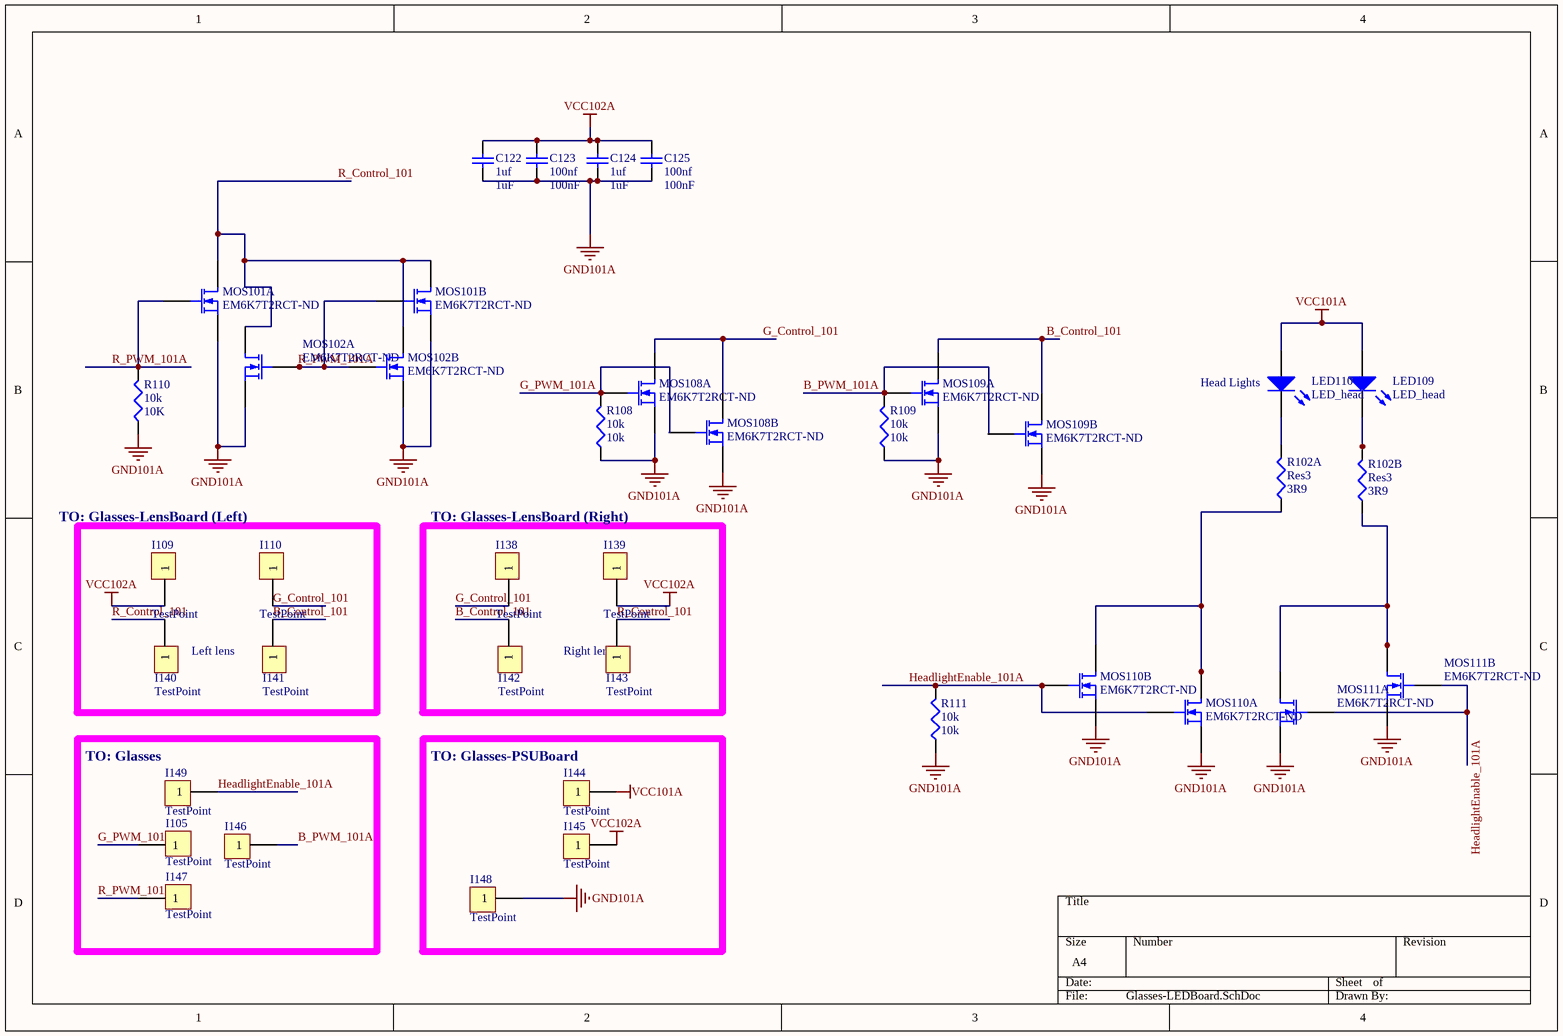
[diagram p4: Glasses-LEDBoard.SchDoc]

### Parts
C122  1uf  [0603]
C123  100nf  [0603]
C124  1uf  [0603]
C125  100nf  [0603]
I105  TestPoint  [TestPoint]
I109  TestPoint  [TestPoint]
I110  TestPoint  [TestPoint]
I138  TestPoint  [TestPoint]
I139  TestPoint  [TestPoint]
I140  TestPoint  [TestPoint]
I141  TestPoint  [TestPoint]
I142  TestPoint  [TestPoint]
I143  TestPoint  [TestPoint]
I144  TestPoint  [TestPoint]
I145  TestPoint  [TestPoint]
I146  TestPoint  [TestPoint]
I147  TestPoint  [TestPoint]
I148  TestPoint  [TestPoint]
I149  TestPoint  [TestPoint]
LED109  LED_head  [LED Headlamp]
LED110  LED_head  [LED Headlamp]
MOS101  EM6K7T2RCT-ND  [EM6K7T2R-EMT6]  (parts A,B of 2)
MOS102  EM6K7T2RCT-ND  [EM6K7T2R-EMT6]  (parts A,B of 2)
MOS108  EM6K7T2RCT-ND  [EM6K7T2R-EMT6]  (parts A,B of 2)
MOS109  EM6K7T2RCT-ND  [EM6K7T2R-EMT6]  (parts A,B of 2)
MOS110  EM6K7T2RCT-ND  [EM6K7T2R-EMT6]  (parts A,B of 2)
MOS111  EM6K7T2RCT-ND  [EM6K7T2R-EMT6]  (parts A,B of 2)
R102A  Res3  value 3R9  [0805]
R102B  Res3  value 3R9  [0805]
R108  10k  [0603]
R109  10k  [0603]
R110  10k  [0603]
R111  10k  [0603]

### Blocks framed on the sheet
Left lens: I109 I110 I140 I141
TO: Glasses-LensBoard (Right): I138 I139 I142 I143
TO: Glasses: I105 I146 I147 I149
TO: Glasses-PSUBoard: I144 I145 I148

### Nets
GND101A: C122.1 C123.1 C124.1 C125.1 I148.1 MOS101.1(S) MOS101.4(S) MOS102.1(S) MOS102.4(S) MOS108.1(S) MOS108.4(S) MOS109.1(S) MOS109.4(S) MOS110.1(S) MOS110.4(S) MOS111.1(S) MOS111.4(S) R108.1 R109.1 R110.1 R111.1
VCC101A: I144.1 LED109.1(A) LED110.1(A)
VCC102A: C122.2 C123.2 C124.2 C125.2 I109.1 I139.1 I145.1
B_Control_101: I141.1 I142.1 MOS109.3(D) MOS109.6(D)
B_PWM_101A: I146.1 MOS109.2(G) MOS109.5(G) R109.2
G_Control_101: I110.1 I138.1 MOS108.3(D) MOS108.6(D)
G_PWM_101A: I105.1 MOS108.2(G) MOS108.5(G) R108.2
HeadlightEnable_101A: I149.1 MOS110.2(G) MOS110.5(G) MOS111.2(G) MOS111.5(G) R111.2
R_Control_101: I140.1 I143.1 MOS101.3(D) MOS101.6(D) MOS102.3(D) MOS102.6(D)
R_PWM_101A: I147.1 MOS101.2(G) MOS101.5(G) MOS102.2(G) MOS102.5(G) R110.2
NetLED109_2: LED109.2(K) R102B.2
NetLED110_2: LED110.2(K) R102A.2
NetMOS110_3: MOS110.3(D) MOS110.6(D) R102A.1
NetMOS111_3: MOS111.3(D) MOS111.6(D) R102B.1

### Notes on the sheet
- (near LED110) Head Lights
- TO: Glasses-LensBoard (Left)
- (near I143) Right lens

### Library data of the parts
C122-C125 = Cap Semi: Capacitor (Semiconductor SIM Model); Published: 8-Jun-2000; LatestRevisionDate: 29-May-2009; LatestRevisionNote: IPC-7351 Footprint Added.; PackageReference: C1206; Publisher: Altium Limited; PackageDescription: Chip Capacitor
  C122 C124: Value: 1uF
  C123 C125: Value: 100nF
LED109 LED110 = LED0: Typical INFRARED GaAs LED; Published: 8-Jun-2000; LatestRevisionDate: 08-Jul-2005; LatestRevisionNote: Mech Layer 1 removed.; PackageReference: LED-0; Publisher: Altium Limited
R102A R102B R108-R111 = Res3: Resistor; Published: 8-Jun-2000; LatestRevisionDate: 29-May-2009; LatestRevisionNote: IPC-7351 Footprint Added.; PackageReference: J1-0603; Publisher: Altium Limited; PackageDescription: Chip Resistor
  R108 R109 R111: Value: 10k
  R110: Value: 10K
MOS101 MOS102 MOS108-MOS111 = EM6K7T2RCT-ND: Supplier 1: Digi-Key

## Sheet Glasses-PSUBoard.SchDoc
size A3
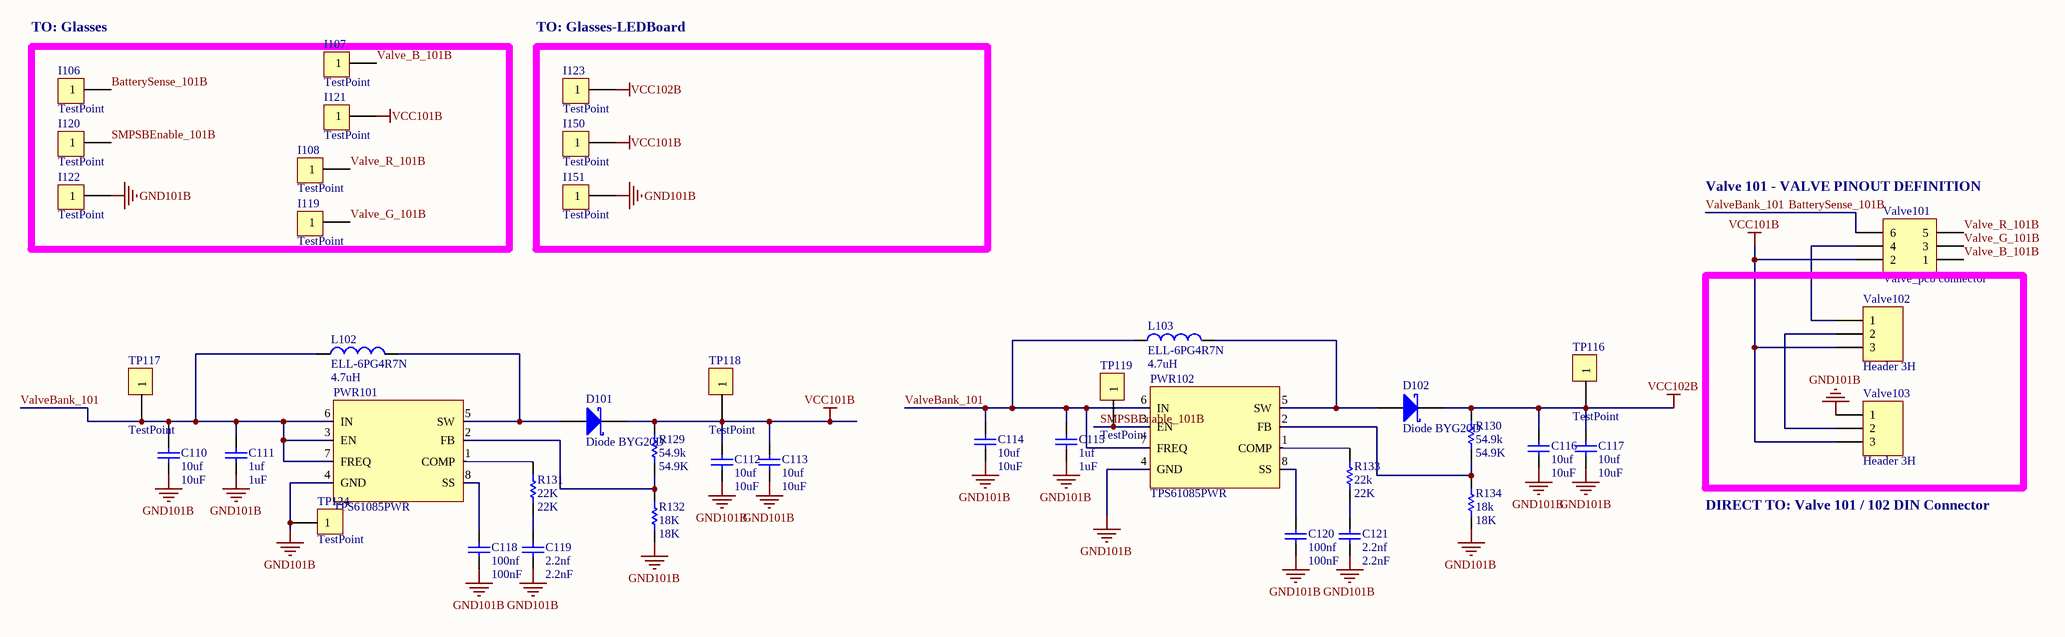
[diagram p5: Glasses-PSUBoard.SchDoc]

### Parts
C110  10uf  [0805]
C111  1uf  [0603]
C112  10uf  [0805]
C113  10uf  [0805]
C114  10uf  [0805]
C115  1uf  [0603]
C116  10uf  [0805]
C117  10uf  [0805]
C118  100nf  [0603]
C119  2.2nf  [0402]
C120  100nf  [0603]
C121  2.2nf  [0402]
D101  Diode BYG20D  [BYG20J-E3]
D102  Diode BYG20D  [BYG20J-E3]
I106  TestPoint  [TestPoint]
I107  TestPoint  [TestPoint]
I108  TestPoint  [TestPoint]
I119  TestPoint  [TestPoint]
I120  TestPoint  [TestPoint]
I121  TestPoint  [TestPoint]
I122  TestPoint  [TestPoint]
I123  TestPoint  [TestPoint]
I150  TestPoint  [TestPoint]
I151  TestPoint  [TestPoint]
L102  ELL-6PG4R7N  value 4.7uH  [ELL6PG4R7N-2CHK]
L103  ELL-6PG4R7N  value 4.7uH  [ELL6PG4R7N-2CHK]
PWR101  TPS61085PWR  [TPS61085-MSOP8]
PWR102  TPS61085PWR  [TPS61085-MSOP8]
R129  54.9k  [0603]
R130  54.9k  [0603]
R131  22K  [0603]
R132  18K  [0603]
R133  22k  [0603]
R134  18k  [0603]
TP116  TestPoint  [TestPoint]
TP117  TestPoint  [TestPoint]
TP118  TestPoint  [TestPoint]
TP119  TestPoint  [TestPoint]
TP124  TestPoint  [TestPoint]
Valve101  Valve_pcb connector  [Valve_pcb mount]
Valve102  Header 3H  [Valve_3 pin]
Valve103  Header 3H  [Valve_3 pin]

### Blocks framed on the sheet
TO: Glasses: I106-I108 I119-I122
TO: Glasses-LEDBoard: I123 I150 I151

### Nets
GND101B: C110.1 C111.1 C112.1 C113.1 C114.1 C115.1 C116.1 C117.1 C118.1 C119.1 C120.1 C121.1 I122.1 I151.1 PWR101.4(GND) PWR102.4(GND) R132.1 R134.1 TP124.1 Valve103.1
VCC101B: C112.2 C113.2 D101.1(K) I121.1 I150.1 R129.2 TP118.1 Valve101.2 Valve102.3 Valve103.3
VCC102B: C116.2 C117.2 D102.1(K) I123.1 R130.2 TP116.1
BatterySense_101B: C110.2 C111.2 C114.2 C115.2 I106.1 L102.1 L103.1 PWR101.3(EN) PWR101.6(IN) PWR101.7(FREQ) PWR102.6(IN) PWR102.7(FREQ) TP117.1 Valve101.6  [also labelled ValveBank_101]
SMPSBEnable_101B: I120.1 PWR102.3(EN) TP119.1
Valve_B_101B: I107.1 Valve101.1
Valve_G_101B: I119.1 Valve101.3
Valve_R_101B: I108.1 Valve101.5
NetC118_2: C118.2 PWR101.8(SS)
NetC119_2: C119.2 R131.1
NetC120_2: C120.2 PWR102.8(SS)
NetC121_2: C121.2 R133.1
NetD101_3: D101.3(A) L102.2 PWR101.5(SW)
NetD102_3: D102.3(A) L103.2 PWR102.5(SW)
NetPWR101_1: PWR101.1(COMP) R131.2
NetPWR101_2: PWR101.2(FB) R129.1 R132.2
NetPWR102_1: PWR102.1(COMP) R133.2
NetPWR102_2: PWR102.2(FB) R130.1 R134.2
NetValve101_4: Valve101.4 Valve102.1
NetValve102_2: Valve102.2 Valve103.2

### Notes on the sheet
- (near Valve101) Valve 101 - VALVE PINOUT DEFINITION
- DIRECT TO: Valve 101 / 102 DIN Connector

### Library data of the parts
C110-C121 = Cap Semi: Capacitor (Semiconductor SIM Model); Published: 8-Jun-2000; LatestRevisionDate: 29-May-2009; LatestRevisionNote: IPC-7351 Footprint Added.; PackageReference: C1206; Publisher: Altium Limited; PackageDescription: Chip Capacitor
  C110 C112-C114 C116 C117: Value: 10uF
  C111 C115: Value: 1uF
  C118 C120: Value: 100nF
  C119 C121: Value: 2.2nF
D101 D102 = Diode 10TQ035: as D201 on sheet Controller; Published: 8-Jun-2000; LatestRevisionDate: 17-Jul-2002; LatestRevisionNote: Re-released for DXP Platform.; DatasheetVersion: PD-2.057B; PackageVersion: Feb-1998; PackageReference: TO-220AC; Publisher: Altium Limited; ComponentLink1Description: Manufacturer Link; ComponentLink1URL: http://www.irf.com/; ComponentLink2Description: Datasheet; ComponentLink2URL: http://www.irf.com/product-info/datasheets/data/10tq.pdf
L102 L103 = Inductor: Code_IEC: 1005; Published: 8-Jun-2000; LatestRevisionDate: 29-May-2009; LatestRevisionNote: IPC-7351 Footprint Added.; PackageReference: 0402-A; Publisher: Altium Limited; PackageDescription: Chip Inductor; Code_JEITA: 0402
R129-R134 = Res1: Resistor; Published: 8-Jun-2000; LatestRevisionDate: 17-Jul-2002; LatestRevisionNote: Re-released for DXP Platform.; PackageReference: AXIAL-0.3; Publisher: Altium Limited
  R129 R130: Value: 54.9K
  R131 R133: Value: 22K
  R132 R134: Value: 18K
Valve101 = Header 3X2H: Header, 3-Pin, Dual row, Right Angle; LatestRevisionDate: 17-Jul-2002; LatestRevisionNote: Re-released for DXP Platform.; Publisher: Altium Limited
Valve102 Valve103 = Header 3H: Header, 3-Pin, Right Angle; LatestRevisionDate: 17-Jul-2002; LatestRevisionNote: Re-released for DXP Platform.; Publisher: Altium Limited

## Sheet Controller-IOBoard.SchDoc
size A2
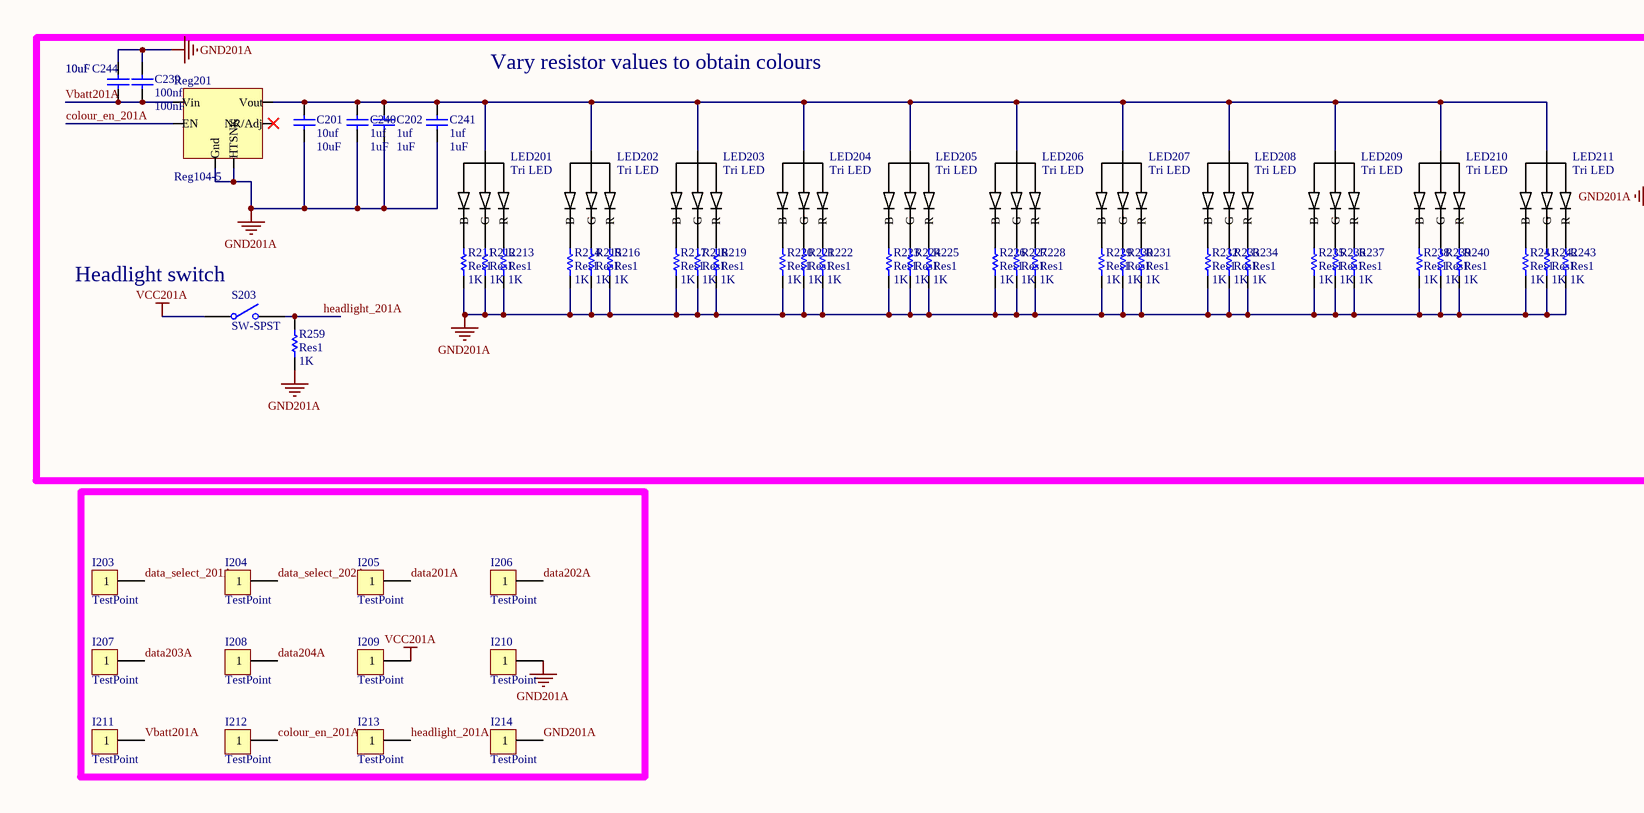
[diagram p6: Controller-IOBoard.SchDoc, left]
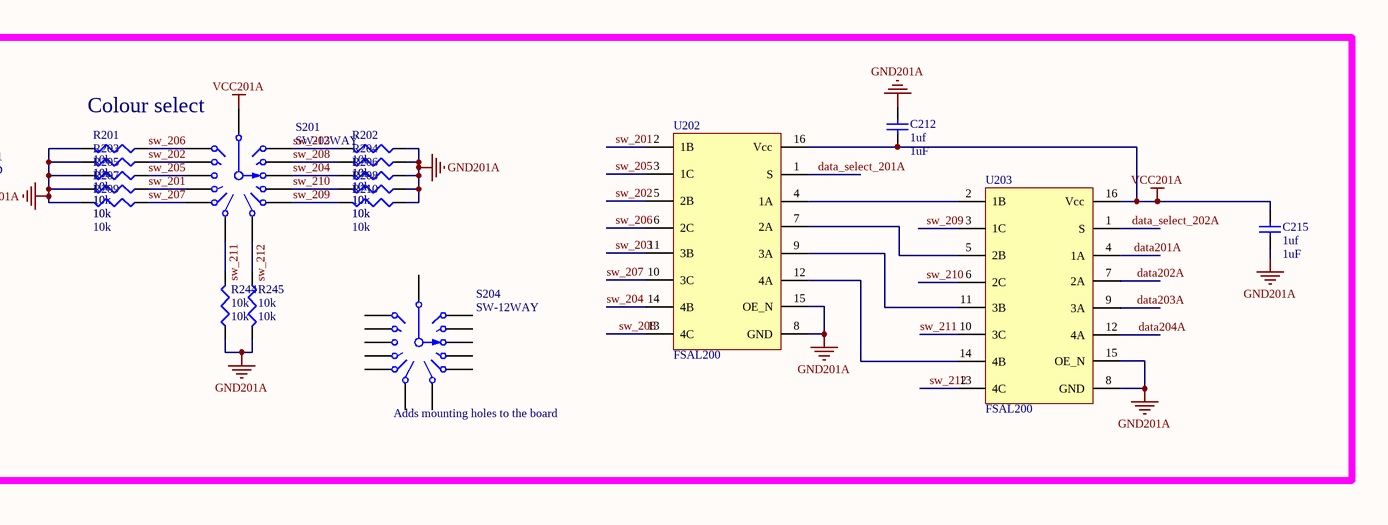
[diagram p7: Controller-IOBoard.SchDoc, right]

### Parts
C201  10uf  [0805]
C202  1uf  [0603]
C212  1uf  [0603]
C215  1uf  [0603]
C239  100nf  [0603]
C240  1uf  [0603]
C241  1uf  [0603]
C244  10uf  [0805]
I203  TestPoint  [TestPoint]
I204  TestPoint  [TestPoint]
I205  TestPoint  [TestPoint]
I206  TestPoint  [TestPoint]
I207  TestPoint  [TestPoint]
I208  TestPoint  [TestPoint]
I209  TestPoint  [TestPoint]
I210  TestPoint  [TestPoint]
I211  TestPoint  [TestPoint]
I212  TestPoint  [TestPoint]
I213  TestPoint  [TestPoint]
I214  TestPoint  [TestPoint]
LED201  Tri LED  [CLV1A-FKB]
LED202  Tri LED  [CLV1A-FKB]
LED203  Tri LED  [CLV1A-FKB]
LED204  Tri LED  [CLV1A-FKB]
LED205  Tri LED  [CLV1A-FKB]
LED206  Tri LED  [CLV1A-FKB]
LED207  Tri LED  [CLV1A-FKB]
LED208  Tri LED  [CLV1A-FKB]
LED209  Tri LED  [CLV1A-FKB]
LED210  Tri LED  [CLV1A-FKB]
LED211  Tri LED  [CLV1A-FKB]
R201  10k  [0603]
R202  10k  [0603]
R203  10k  [0603]
R204  10k  [0603]
R205  10k  [0603]
R206  10k  [0603]
R207  10k  [0603]
R208  10k  [0603]
R209  10k  [0603]
R210  10k  [0603]
R211  Res1  value 1K  [0805]
R212  Res1  value 1K  [0805]
R213  Res1  value 1K  [0805]
R214  Res1  value 1K  [0805]
R215  Res1  value 1K  [0805]
R216  Res1  value 1K  [0805]
R217  Res1  value 1K  [0805]
R218  Res1  value 1K  [0805]
R219  Res1  value 1K  [0805]
R220  Res1  value 1K  [0805]
R221  Res1  value 1K  [0805]
R222  Res1  value 1K  [0805]
R223  Res1  value 1K  [0805]
R224  Res1  value 1K  [0805]
R225  Res1  value 1K  [0805]
R226  Res1  value 1K  [0805]
R227  Res1  value 1K  [0805]
R228  Res1  value 1K  [0805]
R229  Res1  value 1K  [0805]
R230  Res1  value 1K  [0805]
R231  Res1  value 1K  [0805]
R232  Res1  value 1K  [0805]
R233  Res1  value 1K  [0805]
R234  Res1  value 1K  [0805]
R235  Res1  value 1K  [0805]
R236  Res1  value 1K  [0805]
R237  Res1  value 1K  [0805]
R238  Res1  value 1K  [0805]
R239  Res1  value 1K  [0805]
R240  Res1  value 1K  [0805]
R241  Res1  value 1K  [0805]
R242  Res1  value 1K  [0805]
R243  Res1  value 1K  [0805]
R244  10k  [0603]
R245  10k  [0603]
R259  Res1  value 1K  [0805]
Reg201  Reg104-5  [REG104-5-DDPAK5]
S201  SW-12WAY  [switch pad layout]
S203  SW-SPST  [2 pin switch (surface mount)]
S204  SW-12WAY  [12 pole switch]
U202  FSAL200  [FSAL200-16QSOP]
U203  FSAL200  [FSAL200-16QSOP]

### Nets
GND201A: C201.1 C202.1 C212.2 C215.1 C239.2 C240.1 C241.1 C244.2 I210.1 I214.1 R201.2 R202.1 R203.2 R204.1 R205.2 R206.1 R207.2 R208.1 R209.2 R210.1 R211.1 R212.1 R213.1 R214.1 R215.1 R216.1 R217.1 R218.1 R219.1 R220.1 R221.1 R222.1 R223.1 R224.1 R225.1 R226.1 R227.1 R228.1 R229.1 R230.1 R231.1 R232.1 R233.1 R234.1 R235.1 R236.1 R237.1 R238.1 R239.1 R240.1 R241.1 R242.1 R243.1 R244.1 R245.2 R259.2 Reg201.3(Gnd) Reg201.6(HTSNK) U202.8(GND) U202.15(OE_N) U203.8(GND) U203.15(OE_N)
VCC201A: C212.1 C215.2 I209.1 S201.14 S203.1(COMMON) U202.16(Vcc) U203.16(Vcc)
colour_en_201A: I212.1 Reg201.5(EN)
data201A: I205.1 U203.4(1A)
data202A: I206.1 U203.7(2A)
data203A: I207.1 U203.9(3A)
data204A: I208.1 U203.12(4A)
data_select_201A: I203.1 U202.1(S)
data_select_202A: I204.1 U203.1(S)
headlight_201A: I213.1 R259.1 S203.2(NO)
sw_201: R207.1 S201.5 U202.2(1B)
sw_202: R203.1 S201.2 U202.5(2B)
sw_203: R202.2 S201.7 U202.11(3B)
sw_204: R206.2 S201.9 U202.14(4B)
sw_205: R205.1 S201.3 U202.3(1C)
sw_206: R201.1 S201.1 U202.6(2C)
sw_207: R209.1 S201.6 U202.10(3C)
sw_208: R204.2 S201.8 U202.13(4C)
sw_209: R210.2 S201.11 U203.3(1C)
sw_210: R208.2 S201.10 U203.6(2C)
sw_211: R244.2 S201.12 U203.10(3C)
sw_212: R245.1 S201.13 U203.13(4C)
Vbatt201A: C239.1 C244.1 I211.1 Reg201.1(Vin)
NetC201_2: C201.2 C202.2 C240.2 C241.2 LED201.2(Common) LED202.2(Common) LED203.2(Common) LED204.2(Common) LED205.2(Common) LED206.2(Common) LED207.2(Common) LED208.2(Common) LED209.2(Common) LED210.2(Common) LED211.2(Common) Reg201.2(Vout)
NetLED201_1: LED201.1(R) R213.2
NetLED201_3: LED201.3(B) R211.2
NetLED201_4: LED201.4(G) R212.2
NetLED202_1: LED202.1(R) R216.2
NetLED202_3: LED202.3(B) R214.2
NetLED202_4: LED202.4(G) R215.2
NetLED203_1: LED203.1(R) R219.2
NetLED203_3: LED203.3(B) R217.2
NetLED203_4: LED203.4(G) R218.2
NetLED204_1: LED204.1(R) R222.2
NetLED204_3: LED204.3(B) R220.2
NetLED204_4: LED204.4(G) R221.2
NetLED205_1: LED205.1(R) R225.2
NetLED205_3: LED205.3(B) R223.2
NetLED205_4: LED205.4(G) R224.2
NetLED206_1: LED206.1(R) R228.2
NetLED206_3: LED206.3(B) R226.2
NetLED206_4: LED206.4(G) R227.2
NetLED207_1: LED207.1(R) R231.2
NetLED207_3: LED207.3(B) R229.2
NetLED207_4: LED207.4(G) R230.2
NetLED208_1: LED208.1(R) R234.2
NetLED208_3: LED208.3(B) R232.2
NetLED208_4: LED208.4(G) R233.2
NetLED209_1: LED209.1(R) R237.2
NetLED209_3: LED209.3(B) R235.2
NetLED209_4: LED209.4(G) R236.2
NetLED210_1: LED210.1(R) R240.2
NetLED210_3: LED210.3(B) R238.2
NetLED210_4: LED210.4(G) R239.2
NetLED211_1: LED211.1(R) R243.2
NetLED211_3: LED211.3(B) R241.2
NetLED211_4: LED211.4(G) R242.2
NetU202_4: U202.4(1A) U203.2(1B)
NetU202_7: U202.7(2A) U203.5(2B)
NetU202_9: U202.9(3A) U203.11(3B)
NetU202_12: U202.12(4A) U203.14(4B)

Not connected (* = marked no-connect by the designer): Reg201 4(NR/Adj)*; S204 1 2 3 5 6 7 8 9 10 11 12 13 14

### Notes on the sheet
- Vary resistor values to obtain colours
- (near S201) Colour select
- (near S203) Headlight switch
- (near S204) Adds mounting holes to the board

### Library data of the parts
C201 C202 C212 C215 C239-C241 C244 = Cap Semi: Capacitor (Semiconductor SIM Model); Published: 8-Jun-2000; LatestRevisionDate: 29-May-2009; LatestRevisionNote: IPC-7351 Footprint Added.; PackageReference: C1206; Publisher: Altium Limited; PackageDescription: Chip Capacitor
  C201 C244: Value: 10uF
  C202 C212 C215 C240 C241: Value: 1uF
  C239: Value: 100nF
R201-R210 R244 R245 = Res3: Resistor; Published: 8-Jun-2000; LatestRevisionDate: 29-May-2009; LatestRevisionNote: IPC-7351 Footprint Added.; PackageReference: J1-0603; Publisher: Altium Limited; PackageDescription: Chip Resistor; Value: 10k
R211-R243 R259 = Res1: Resistor; Published: 8-Jun-2000; LatestRevisionDate: 17-Jul-2002; LatestRevisionNote: Re-released for DXP Platform.; PackageReference: AXIAL-0.3; Publisher: Altium Limited
S201 S204 = SW-12WAY: 12 Way Switch; Published: 24-Mar-1999; LatestRevisionDate: 17-Jul-2002; LatestRevisionNote: Re-released for DXP Platform.; PackageReference: DIP-13(14); Publisher: Altium Limited
S203 = SW-SPST: Single-Pole, Single-Throw Switch; Published: 24-Mar-1999; LatestRevisionDate: 17-Jul-2002; LatestRevisionNote: Re-released for DXP Platform.; PackageReference: SPST-2; Publisher: Altium Limited
U202 U203 = FSAL200: ST Quad Bi-Directional Logic Switch

## Sheet Glasses-LensBoard.SchDoc
size A4
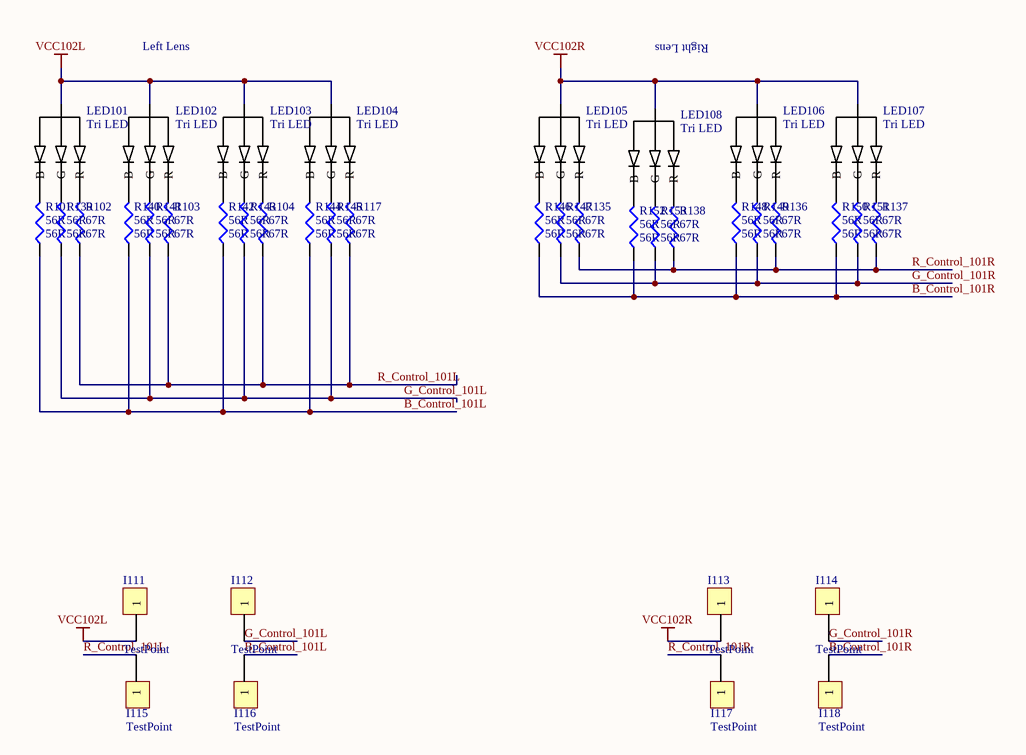
[diagram p8: Glasses-LensBoard.SchDoc]

### Parts
I111  TestPoint  [TestPoint]
I112  TestPoint  [TestPoint]
I113  TestPoint  [TestPoint]
I114  TestPoint  [TestPoint]
I115  TestPoint  [TestPoint]
I116  TestPoint  [TestPoint]
I117  TestPoint  [TestPoint]
I118  TestPoint  [TestPoint]
LED101  Tri LED  [CLV1A-FKB]
LED102  Tri LED  [CLV1A-FKB]
LED103  Tri LED  [CLV1A-FKB]
LED104  Tri LED  [CLV1A-FKB]
LED105  Tri LED  [CLV1A-FKB]
LED106  Tri LED  [CLV1A-FKB]
LED107  Tri LED  [CLV1A-FKB]
LED108  Tri LED  [CLV1A-FKB]
R101  56R  [0603]
R102  67R  [0603]
R103  67R  [0603]
R104  67R  [0603]
R117  67R  [0603]
R135  67R  [0603]
R136  67R  [0603]
R137  67R  [0603]
R138  67R  [0603]
R139  56R  [0603]
R140  56R  [0603]
R141  56R  [0603]
R142  56R  [0603]
R143  56R  [0603]
R144  56R  [0603]
R145  56R  [0603]
R146  56R  [0603]
R147  56R  [0603]
R148  56R  [0603]
R149  56R  [0603]
R150  56R  [0603]
R151  56R  [0603]
R152  56R  [0603]
R153  56R  [0603]

### Nets
VCC102L: I111.1 LED101.2(Common) LED102.2(Common) LED103.2(Common) LED104.2(Common)
VCC102R: I113.1 LED105.2(Common) LED106.2(Common) LED107.2(Common) LED108.2(Common)
B_Control_101L: I116.1 R101.1 R140.1 R142.1 R144.1
B_Control_101R: I118.1 R146.1 R148.1 R150.1 R152.1
G_Control_101L: I112.1 R139.1 R141.1 R143.1 R145.1
G_Control_101R: I114.1 R147.1 R149.1 R151.1 R153.1
R_Control_101L: I115.1 R102.1 R103.1 R104.1 R117.1
R_Control_101R: I117.1 R135.1 R136.1 R137.1 R138.1
NetLED101_1: LED101.1(R) R102.2
NetLED101_3: LED101.3(B) R101.2
NetLED101_4: LED101.4(G) R139.2
NetLED102_1: LED102.1(R) R103.2
NetLED102_3: LED102.3(B) R140.2
NetLED102_4: LED102.4(G) R141.2
NetLED103_1: LED103.1(R) R104.2
NetLED103_3: LED103.3(B) R142.2
NetLED103_4: LED103.4(G) R143.2
NetLED104_1: LED104.1(R) R117.2
NetLED104_3: LED104.3(B) R144.2
NetLED104_4: LED104.4(G) R145.2
NetLED105_1: LED105.1(R) R135.2
NetLED105_3: LED105.3(B) R146.2
NetLED105_4: LED105.4(G) R147.2
NetLED106_1: LED106.1(R) R136.2
NetLED106_3: LED106.3(B) R148.2
NetLED106_4: LED106.4(G) R149.2
NetLED107_1: LED107.1(R) R137.2
NetLED107_3: LED107.3(B) R150.2
NetLED107_4: LED107.4(G) R151.2
NetLED108_1: LED108.1(R) R138.2
NetLED108_3: LED108.3(B) R152.2
NetLED108_4: LED108.4(G) R153.2

### Notes on the sheet
- Right Lens
- Left Lens

### Library data of the parts
R101-R104 R117 R135-R153 = Res3: Resistor; Published: 8-Jun-2000; LatestRevisionDate: 29-May-2009; LatestRevisionNote: IPC-7351 Footprint Added.; PackageReference: J1-0603; Publisher: Altium Limited; PackageDescription: Chip Resistor
  R101 R139-R153: Value: 56R
  R102-R104 R117 R135-R138: Value: 67R